# EAGLE board enut30d (EAGLE 4.11), part 1 of 2
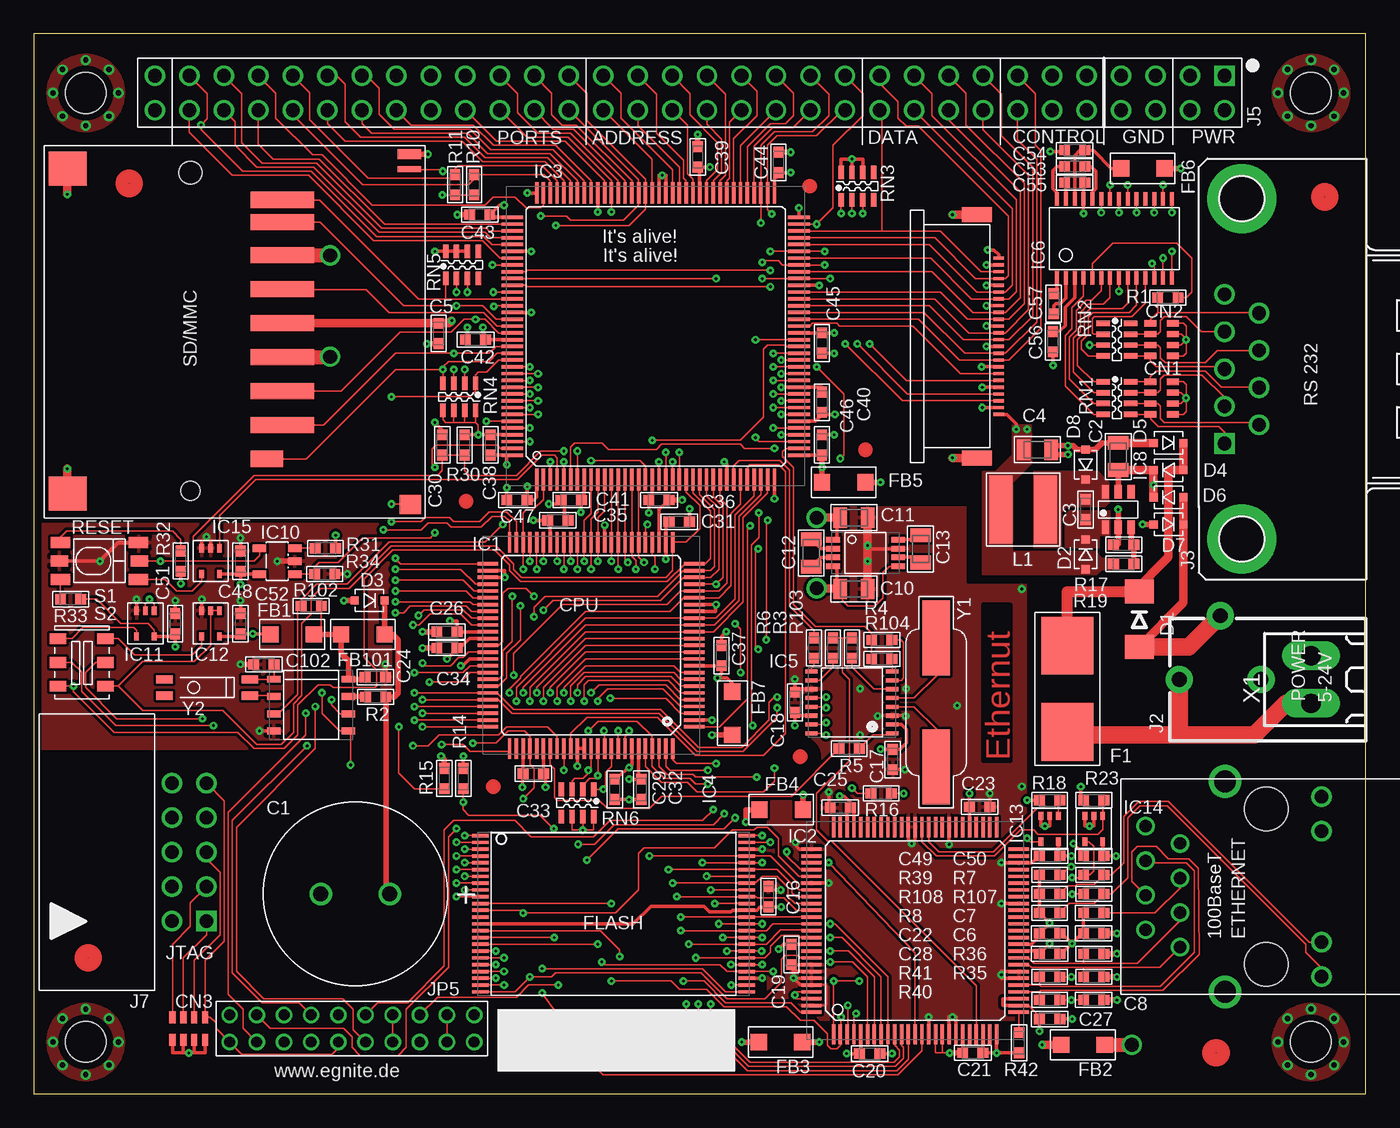
[diagram p4: board, top side]
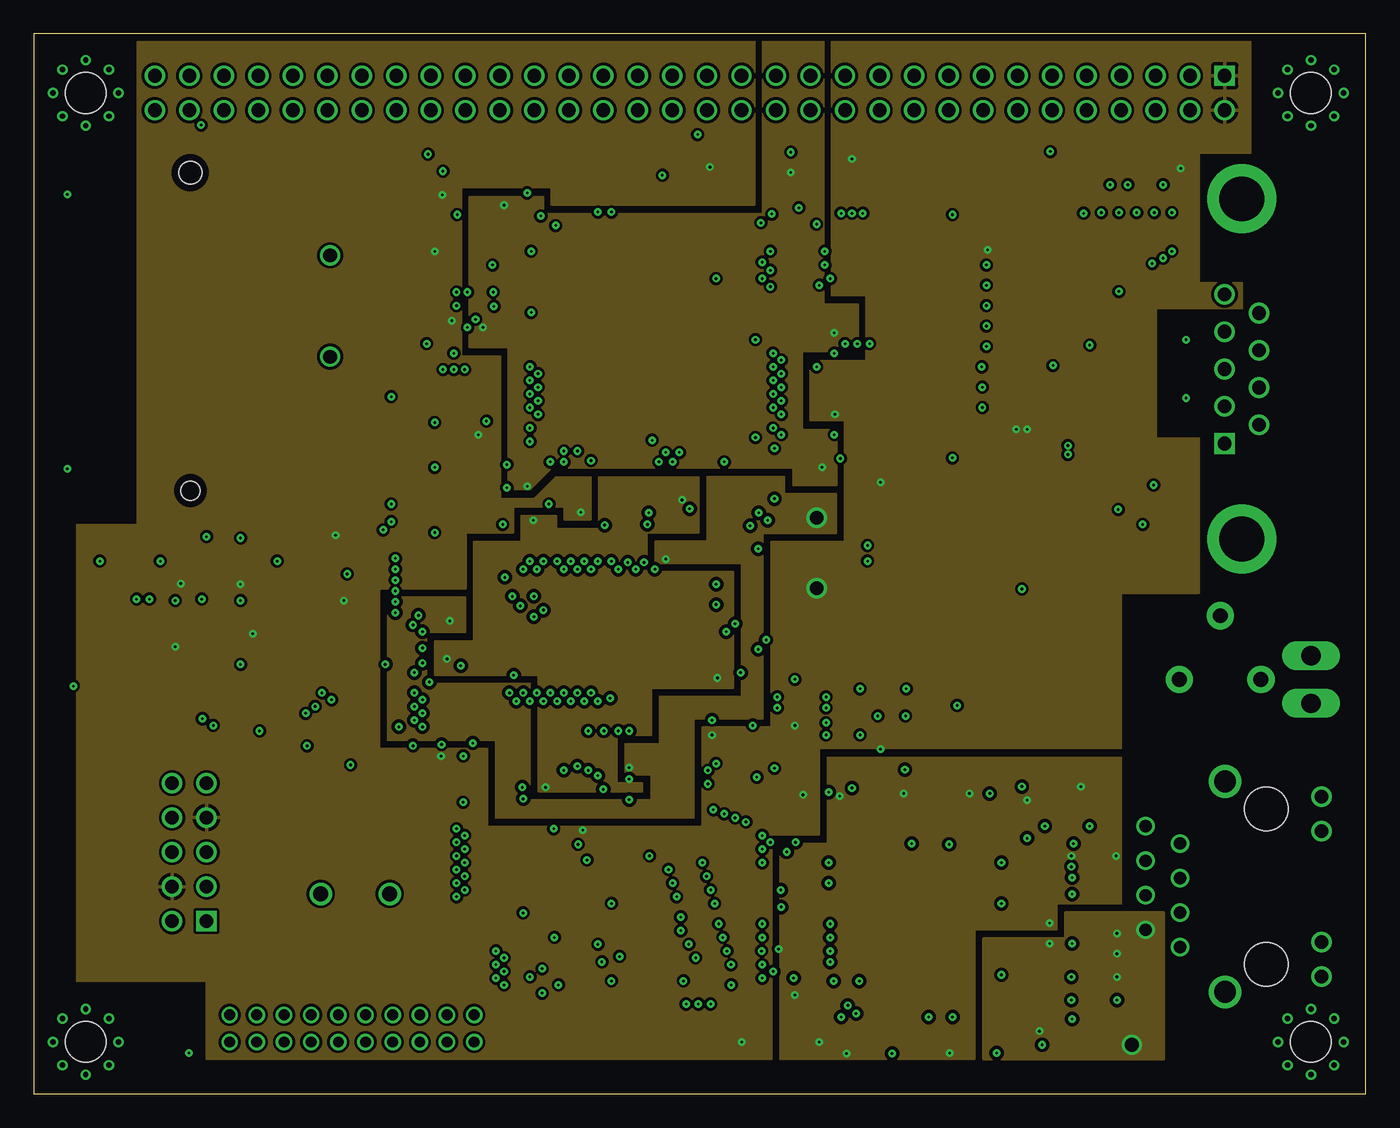
[diagram p5: board, inner layer Supply]
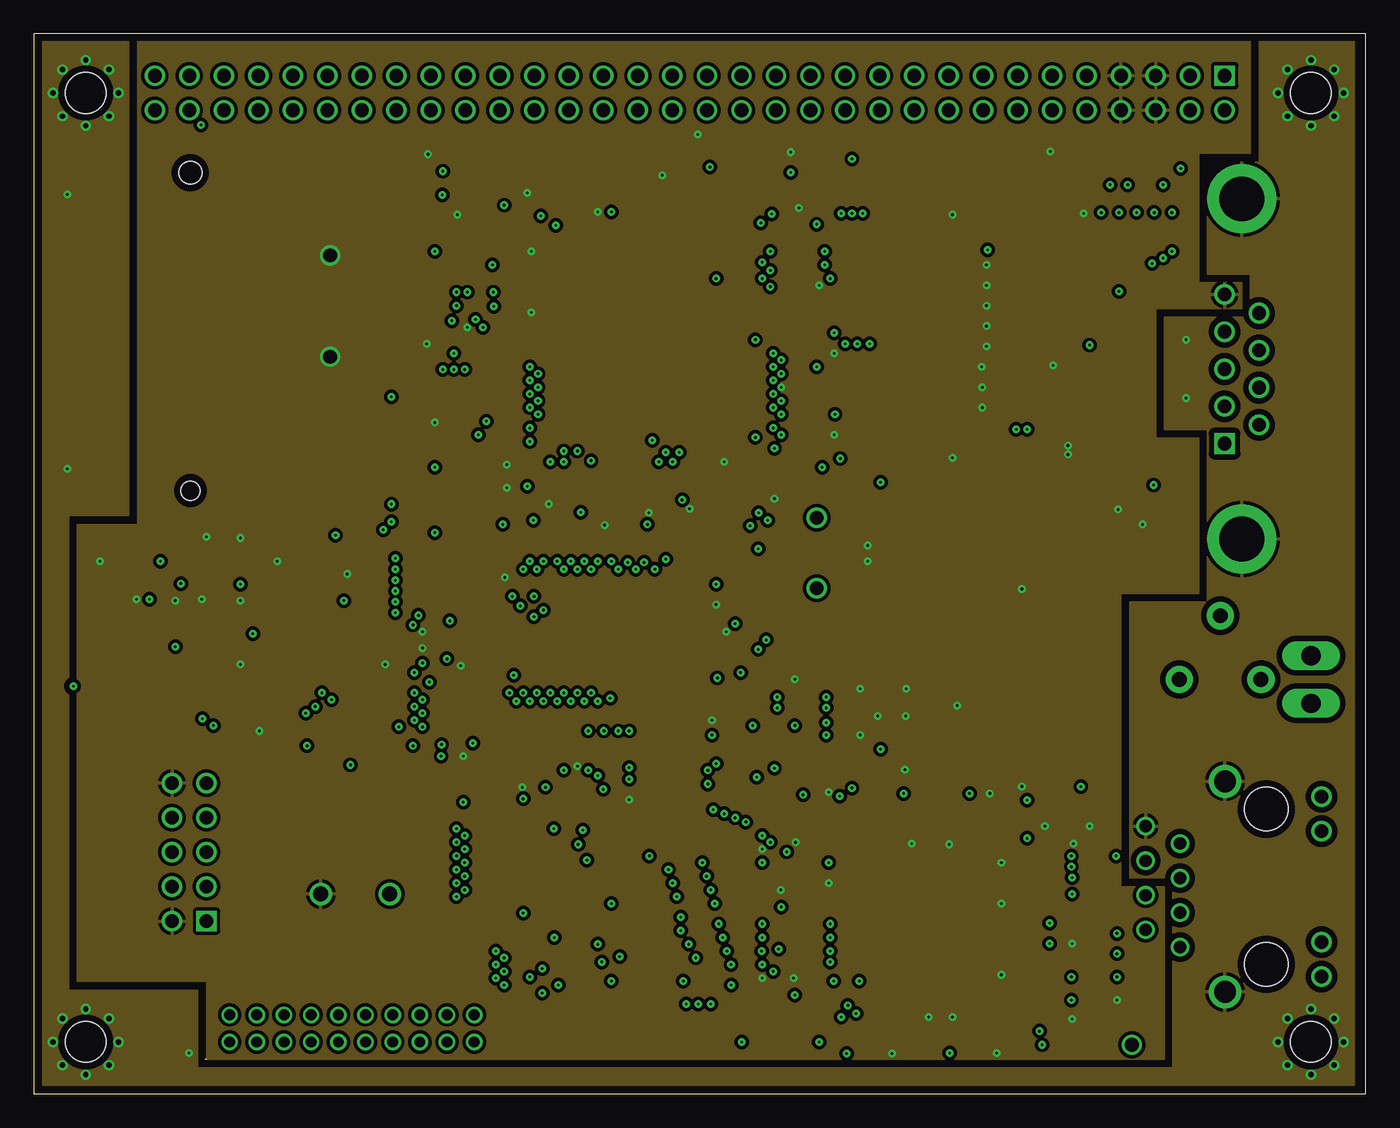
[diagram p6: board, inner layer Ground]
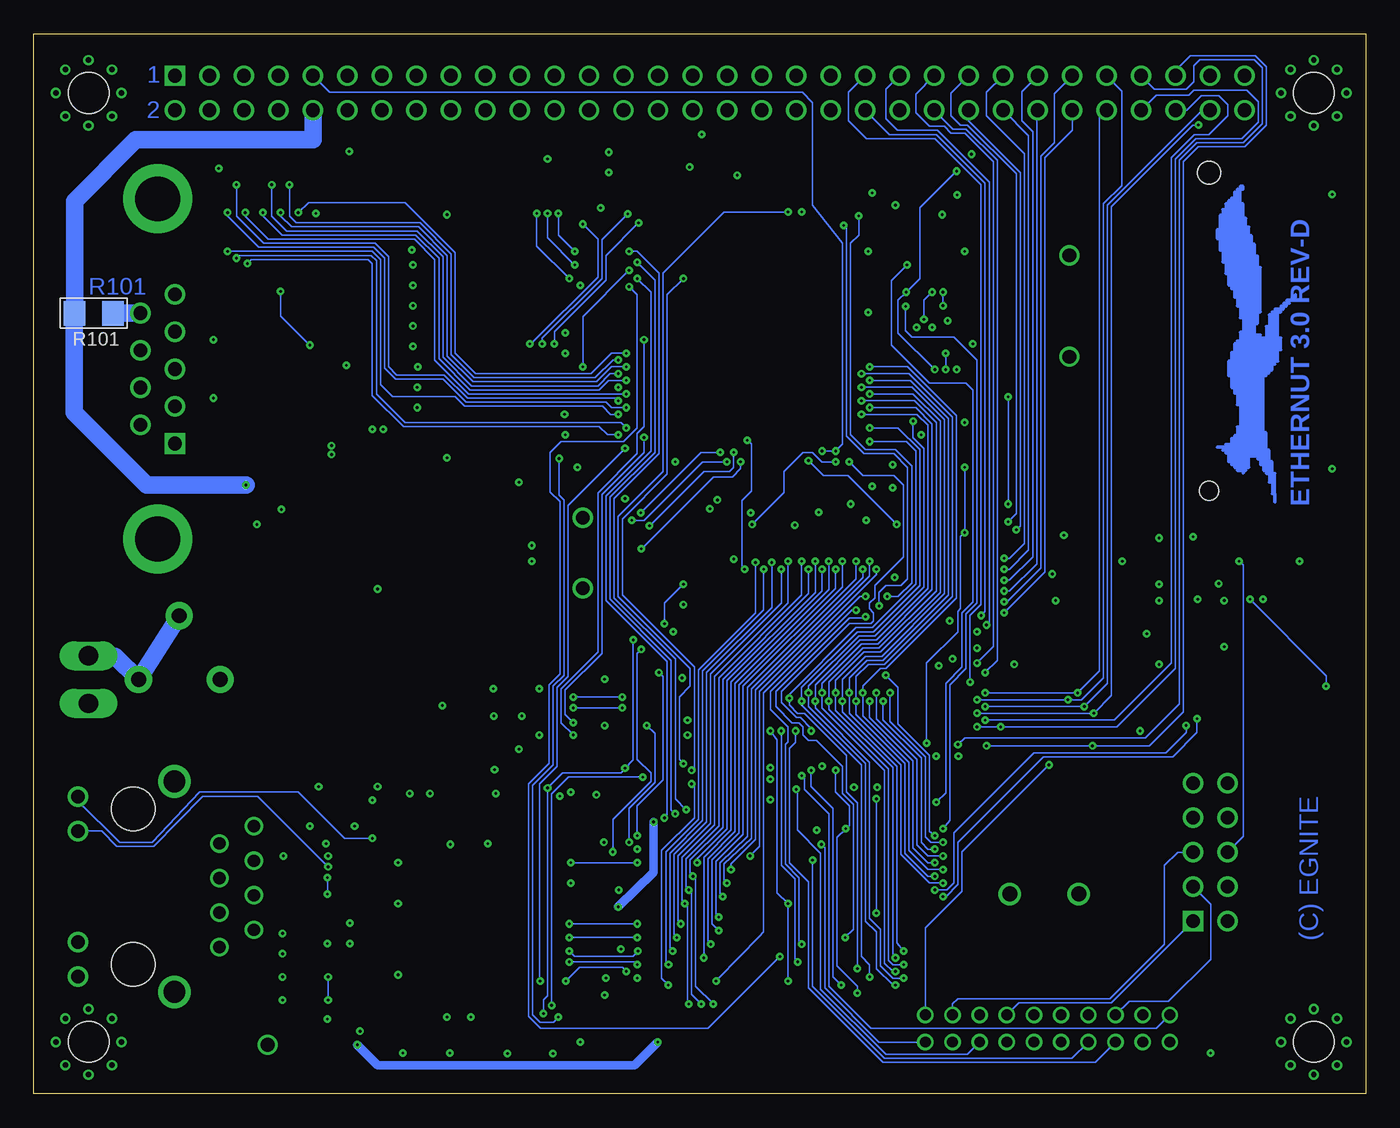
[diagram p7: board, bottom side, seen from below]

Size 98 x 78 mm. Coordinates in mm from the lower left corner, seen from the top.
Outline: 0,0 98,0 98,78 0,78 0,0
Copper layers (1*2+15*16): Top 0.035mm / dielectric 0.5mm / Supply 0.035mm / dielectric 0.5mm / Ground 0.035mm / dielectric 0.5mm / Bottom 0.035mm
Design rules "default": minimum track width 5mil, minimum drill 0.2mm, track to track 6mil, track to pad 6mil, pad to pad 8mil, via to via 8mil, smd to smd 8mil, copper to edge 20mil, drill to drill 12mil, minimum pad ring 8mil, minimum via ring 7mil, stop-mask expansion 0mil, vias tented up to drill 0.1mm, thermal gap 10mil
Net classes: 1 Supply1A: width 0.61 mm; 4 Ground: width 0.406 mm
Holes 3 mm at 3.81,73.66 93.98,73.66 3.81,3.81 93.98,3.81
tRestrict: area 69.9,24.5 to 71.8,36

## Footprints (pad centres in the part's own frame; a part is rotated, then mirrored left to right if it is on the bottom)
CDL13_5 = drill 1.1 pad 1.3 round: + 2.54,0; - -2.54,0
C0805 = smd 1 x 1.5: 1 -1,0; 2 1,0
C0603 = smd 0.8 x 0.75: 1 -0.75,0; 2 0.75,0
NCA1206 = smd 0.46 x 0.89: 1 -1.2,-0.825; 2 -0.4,-0.825; 3 0.4,-0.825; 4 1.2,-0.825; 5 1.2,0.825; 6 0.4,0.825; 7 -0.4,0.825; 8 -1.2,0.825
SMB = smd 1.778 x 2.159: A 2.032,0; C -2.032,0
SOD323 = smd 0.6 x 0.6: A 1.1,0; C -1.1,0
OMNI-BLOK = smd 4.242 x 3.81: 1 -3.175,0; 2 3.175,0
BLM31 = smd 1.2 x 1.2: 1 -1.6,0; 2 1.6,0
TQFP100 = smd 0.25 x 1.5: 1 -6,-7.6; 2 -5.5,-7.6; 3 -5,-7.6; 4 -4.5,-7.6; 5 -4,-7.6; 6 -3.5,-7.6; 7 -3,-7.6; 8 -2.5,-7.6; 9 -2,-7.6; 10 -1.5,-7.6; 11 -1,-7.6; 12 -0.5,-7.6; 13 0,-7.6; 14 0.5,-7.6; 15 1,-7.6; 16 1.5,-7.6; 17 2,-7.6; 18 2.5,-7.6; 19 3,-7.6; 20 3.5,-7.6; 21 4,-7.6; 22 4.5,-7.6; 23 5,-7.6; 24 5.5,-7.6; 25 6,-7.6; 51 6,7.6; 52 5.5,7.6; 53 5,7.6; 54 4.5,7.6; 55 4,7.6; 56 3.5,7.6; 57 3,7.6; 58 2.5,7.6; 59 2,7.6; 60 1.5,7.6; 61 1,7.6; 62 0.5,7.6; 63 0,7.6; 64 -0.5,7.6; 65 -1,7.6; 66 -1.5,7.6; 67 -2,7.6; 68 -2.5,7.6; 69 -3,7.6; 70 -3.5,7.6; 71 -4,7.6; 72 -4.5,7.6; 73 -5,7.6; 74 -5.5,7.6; 75 -6,7.6 | smd 1.5 x 0.25: 26 7.6,-6; 27 7.6,-5.5; 28 7.6,-5; 29 7.6,-4.5; 30 7.6,-4; 31 7.6,-3.5; 32 7.6,-3; 33 7.6,-2.5; 34 7.6,-2; 35 7.6,-1.5; 36 7.6,-1; 37 7.6,-0.5; 38 7.6,0; 39 7.6,0.5; 40 7.6,1; 41 7.6,1.5; 42 7.6,2; 43 7.6,2.5; 44 7.6,3; 45 7.6,3.5; 46 7.6,4; 47 7.6,4.5; 48 7.6,5; 49 7.6,5.5; 50 7.6,6; 76 -7.6,6; 77 -7.6,5.5; 78 -7.6,5; 79 -7.6,4.5; 80 -7.6,4; 81 -7.6,3.5; 82 -7.6,3; 83 -7.6,2.5; 84 -7.6,2; 85 -7.6,1.5; 86 -7.6,1; 87 -7.6,0.5; 88 -7.6,0; 89 -7.6,-0.5; 90 -7.6,-1; 91 -7.6,-1.5; 92 -7.6,-2; 93 -7.6,-2.5; 94 -7.6,-3; 95 -7.6,-3.5; 96 -7.6,-4; 97 -7.6,-4.5; 98 -7.6,-5; 99 -7.6,-5.5; 100 -7.6,-6
LQFP100 = smd 0.25 x 1.5: 1 -6,-7.625; 2 -5.5,-7.625; 3 -5,-7.625; 4 -4.5,-7.625; 5 -4,-7.625; 6 -3.5,-7.625; 7 -3,-7.625; 8 -2.5,-7.625; 9 -2,-7.625; 10 -1.5,-7.625; 11 -1,-7.625; 12 -0.5,-7.625; 13 0,-7.625; 14 0.5,-7.625; 15 1,-7.625; 16 1.5,-7.625; 17 2,-7.625; 18 2.5,-7.625; 19 3,-7.625; 20 3.5,-7.625; 21 4,-7.625; 22 4.5,-7.625; 23 5,-7.625; 24 5.5,-7.625; 25 6,-7.625; 51 6,7.625; 52 5.5,7.625; 53 5,7.625; 54 4.5,7.625; 55 4,7.625; 56 3.5,7.625; 57 3,7.625; 58 2.5,7.625; 59 2,7.625; 60 1.5,7.625; 61 1,7.625; 62 0.5,7.625; 63 0,7.625; 64 -0.5,7.625; 65 -1,7.625; 66 -1.5,7.625; 67 -2,7.625; 68 -2.5,7.625; 69 -3,7.625; 70 -3.5,7.625; 71 -4,7.625; 72 -4.5,7.625; 73 -5,7.625; 74 -5.5,7.625; 75 -6,7.625 | smd 1.5 x 0.25: 26 7.625,-6; 27 7.625,-5.5; 28 7.625,-5; 29 7.625,-4.5; 30 7.625,-4; 31 7.625,-3.5; 32 7.625,-3; 33 7.625,-2.5; 34 7.625,-2; 35 7.625,-1.5; 36 7.625,-1; 37 7.625,-0.5; 38 7.625,0; 39 7.625,0.5; 40 7.625,1; 41 7.625,1.5; 42 7.625,2; 43 7.625,2.5; 44 7.625,3; 45 7.625,3.5; 46 7.625,4; 47 7.625,4.5; 48 7.625,5; 49 7.625,5.5; 50 7.625,6; 76 -7.625,6; 77 -7.625,5.5; 78 -7.625,5; 79 -7.625,4.5; 80 -7.625,4; 81 -7.625,3.5; 82 -7.625,3; 83 -7.625,2.5; 84 -7.625,2; 85 -7.625,1.5; 86 -7.625,1; 87 -7.625,0.5; 88 -7.625,0; 89 -7.625,-0.5; 90 -7.625,-1; 91 -7.625,-1.5; 92 -7.625,-2; 93 -7.625,-2.5; 94 -7.625,-3; 95 -7.625,-3.5; 96 -7.625,-4; 97 -7.625,-4.5; 98 -7.625,-5; 99 -7.625,-5.5; 100 -7.625,-6
XC95_TQ144 = smd 0.25 x 1.6: 1 -8.75,-10.55; 2 -8.25,-10.55; 3 -7.75,-10.55; 4 -7.25,-10.55; 5 -6.75,-10.55; 6 -6.25,-10.55; 7 -5.75,-10.55; 8 -5.25,-10.55; 9 -4.75,-10.55; 10 -4.25,-10.55; 11 -3.75,-10.55; 12 -3.25,-10.55; 13 -2.75,-10.55; 14 -2.25,-10.55; 15 -1.75,-10.55; 16 -1.25,-10.55; 17 -0.75,-10.55; 18 -0.25,-10.55; 19 0.25,-10.55; 20 0.75,-10.55; 21 1.25,-10.55; 22 1.75,-10.55; 23 2.25,-10.55; 24 2.75,-10.55; 25 3.25,-10.55; 26 3.75,-10.55; 27 4.25,-10.55; 28 4.75,-10.55; 29 5.25,-10.55; 30 5.75,-10.55; 31 6.25,-10.55; 32 6.75,-10.55; 33 7.25,-10.55; 34 7.75,-10.55; 35 8.25,-10.55; 36 8.75,-10.55; 73 8.75,10.55; 74 8.25,10.55; 75 7.75,10.55; 76 7.25,10.55; 77 6.75,10.55; 78 6.25,10.55; 79 5.75,10.55; 80 5.25,10.55; 81 4.75,10.55; 82 4.25,10.55; 83 3.75,10.55; 84 3.25,10.55; 85 2.75,10.55; 86 2.25,10.55; 87 1.75,10.55; 88 1.25,10.55; 89 0.75,10.55; 90 0.25,10.55; 91 -0.25,10.55; 92 -0.75,10.55; 93 -1.25,10.55; 94 -1.75,10.55; 95 -2.25,10.55; 96 -2.75,10.55; 97 -3.25,10.55; 98 -3.75,10.55; 99 -4.25,10.55; 100 -4.75,10.55; 101 -5.25,10.55; 102 -5.75,10.55; 103 -6.25,10.55; 104 -6.75,10.55; 105 -7.25,10.55; 106 -7.75,10.55; 107 -8.25,10.55; 108 -8.75,10.55 | smd 1.6 x 0.25: 37 10.55,-8.75; 38 10.55,-8.25; 39 10.55,-7.75; 40 10.55,-7.25; 41 10.55,-6.75; 42 10.55,-6.25; 43 10.55,-5.75; 44 10.55,-5.25; 45 10.55,-4.75; 46 10.55,-4.25; 47 10.55,-3.75; 48 10.55,-3.25; 49 10.55,-2.75; 50 10.55,-2.25; 51 10.55,-1.75; 52 10.55,-1.25; 53 10.55,-0.75; 54 10.55,-0.25; 55 10.55,0.25; 56 10.55,0.75; 57 10.55,1.25; 58 10.55,1.75; 59 10.55,2.25; 60 10.55,2.75; 61 10.55,3.25; 62 10.55,3.75; 63 10.55,4.25; 64 10.55,4.75; 65 10.55,5.25; 66 10.55,5.75; 67 10.55,6.25; 68 10.55,6.75; 69 10.55,7.25; 70 10.55,7.75; 71 10.55,8.25; 72 10.55,8.75; 109 -10.55,8.75; 110 -10.55,8.25; 111 -10.55,7.75; 112 -10.55,7.25; 113 -10.55,6.75; 114 -10.55,6.25; 115 -10.55,5.75; 116 -10.55,5.25; 117 -10.55,4.75; 118 -10.55,4.25; 119 -10.55,3.75; 120 -10.55,3.25; 121 -10.55,2.75; 122 -10.55,2.25; 123 -10.55,1.75; 124 -10.55,1.25; 125 -10.55,0.75; 126 -10.55,0.25; 127 -10.55,-0.25; 128 -10.55,-0.75; 129 -10.55,-1.25; 130 -10.55,-1.75; 131 -10.55,-2.25; 132 -10.55,-2.75; 133 -10.55,-3.25; 134 -10.55,-3.75; 135 -10.55,-4.25; 136 -10.55,-4.75; 137 -10.55,-5.25; 138 -10.55,-5.75; 139 -10.55,-6.25; 140 -10.55,-6.75; 141 -10.55,-7.25; 142 -10.55,-7.75; 143 -10.55,-8.25; 144 -10.55,-8.75
TSOP48 = smd 0.25 x 1.2: 1 -5.75,-9.8; 2 -5.25,-9.8; 3 -4.75,-9.8; 4 -4.25,-9.8; 5 -3.75,-9.8; 6 -3.25,-9.8; 7 -2.75,-9.8; 8 -2.25,-9.8; 9 -1.75,-9.8; 10 -1.25,-9.8; 11 -0.75,-9.8; 12 -0.25,-9.8; 13 0.25,-9.8; 14 0.75,-9.8; 15 1.25,-9.8; 16 1.75,-9.8; 17 2.25,-9.8; 18 2.75,-9.8; 19 3.25,-9.8; 20 3.75,-9.8; 21 4.25,-9.8; 22 4.75,-9.8; 23 5.25,-9.8; 24 5.75,-9.8; 25 5.75,9.8; 26 5.25,9.8; 27 4.75,9.8; 28 4.25,9.8; 29 3.75,9.8; 30 3.25,9.8; 31 2.75,9.8; 32 2.25,9.8; 33 1.75,9.8; 34 1.25,9.8; 35 0.75,9.8; 36 0.25,9.8; 37 -0.25,9.8; 38 -0.75,9.8; 39 -1.25,9.8; 40 -1.75,9.8; 41 -2.25,9.8; 42 -2.75,9.8; 43 -3.25,9.8; 44 -3.75,9.8; 45 -4.25,9.8; 46 -4.75,9.8; 47 -5.25,9.8; 48 -5.75,9.8
TSSOP16 = smd 0.3 x 0.9: 1 -2.275,-2.97; 2 -1.625,-2.97; 3 -0.975,-2.97; 4 -0.325,-2.97; 5 0.325,-2.97; 6 0.975,-2.97; 7 1.625,-2.97; 8 2.275,-2.97; 9 2.275,2.97; 10 1.625,2.97; 11 0.975,2.97; 12 0.325,2.97; 13 -0.325,2.97; 14 -0.975,2.97; 15 -1.625,2.97; 16 -2.275,2.97
TSSOP28 = smd 0.305 x 0.991: 1 -4.225,-2.918; 2 -3.575,-2.918; 3 -2.925,-2.918; 4 -2.275,-2.918; 5 -1.625,-2.918; 6 -0.975,-2.918; 7 -0.325,-2.918; 8 0.325,-2.918; 9 0.975,-2.918; 10 1.625,-2.918; 11 2.275,-2.918; 12 2.925,-2.918; 13 3.575,-2.918; 14 4.225,-2.918; 15 4.225,2.918; 16 3.575,2.918; 17 2.925,2.918; 18 2.275,2.918; 19 1.625,2.918; 20 0.975,2.918; 21 0.325,2.918; 22 -0.325,2.918; 23 -0.975,2.918; 24 -1.625,2.918; 25 -2.275,2.918; 26 -2.925,2.918; 27 -3.575,2.918; 28 -4.225,2.918
SO8 = smd 0.508 x 0.991: 1 -1.905,-2.743; 2 -0.635,-2.743; 3 0.635,-2.743; 4 1.905,-2.743; 5 1.905,2.743; 6 0.635,2.743; 7 -0.635,2.743; 8 -1.905,2.743
TSOT-23-6 = smd 0.54 x 1: 1 -0.95,-1.31; 2 0,-1.31; 3 0.95,-1.31; 4 0.95,1.31; 5 0,1.31; 6 -0.95,1.31
MSOP-8 = smd 0.41 x 1.02: 1 -0.975,-2.4; 2 -0.325,-2.4; 3 0.325,-2.4; 4 0.975,-2.4; 5 0.975,2.4; 6 0.325,2.4; 7 -0.325,2.4; 8 -0.975,2.4
SOT23-5L = smd 0.55 x 0.99: 1 -0.95,-1.3; 2 0,-1.3; 3 0.95,-1.3; 4 0.95,1.3; 5 -0.95,1.3
SOT353 = smd 0.35 x 0.6: 1 -0.65,-0.95; 2 0,-0.95; 3 0.65,-0.95; 4 0.65,0.95; 5 -0.65,0.95
TDC-002-3 = drill 1.1 pad 2 round: 1 -6.5,0; 2 -0.5,0; 3 -3.5,4.7
M09HP = drill 1.016 square: 1 -5.486,5.08 | drill 1.016 round: 2 -2.743,5.08; 3 0,5.08; 4 2.743,5.08; 5 5.486,5.08; 6 -4.115,2.54; 7 -1.372,2.54; 8 1.372,2.54; 9 4.115,2.54 | drill 3.302 pad 5.08 round: G1 -12.522,3.81; G2 12.522,3.81
FFC-52437 = smd 0.24 x 0.8: 1 -5.75,3.5; 2 -5.25,3.5; 3 -4.75,3.5; 4 -4.25,3.5; 5 -3.75,3.5; 6 -3.25,3.5; 7 -2.75,3.5; 8 -2.25,3.5; 9 -1.75,3.5; 10 -1.25,3.5; 11 -0.75,3.5; 12 -0.25,3.5; 13 0.25,3.5; 14 0.75,3.5; 15 1.25,3.5; 16 1.75,3.5; 17 2.25,3.5; 18 2.75,3.5; 19 3.25,3.5; 20 3.75,3.5; 21 4.25,3.5; 22 4.75,3.5; 23 5.25,3.5; 24 5.75,3.5 | smd 1.1 x 2.2: G1 -8.95,1.9; G2 8.95,1.9
NUTEXP = drill 1 square: 1 39.37,1.27 | drill 1 round: 2 39.37,-1.27; 3 36.83,1.27; 4 36.83,-1.27; 5 34.29,1.27; 6 34.29,-1.27; 7 31.75,1.27; 8 31.75,-1.27; 9 29.21,1.27; 10 29.21,-1.27; 11 26.67,1.27; 12 26.67,-1.27; 13 24.13,1.27; 14 24.13,-1.27; 15 21.59,1.27; 16 21.59,-1.27; 17 19.05,1.27; 18 19.05,-1.27; 19 16.51,1.27; 20 16.51,-1.27; 21 13.97,1.27; 22 13.97,-1.27; 23 11.43,1.27; 24 11.43,-1.27; 25 8.89,1.27; 26 8.89,-1.27; 27 6.35,1.27; 28 6.35,-1.27; 29 3.81,1.27; 30 3.81,-1.27; 31 1.27,1.27; 32 1.27,-1.27; 33 -1.27,1.27; 34 -1.27,-1.27; 35 -3.81,1.27; 36 -3.81,-1.27; 37 -6.35,1.27; 38 -6.35,-1.27; 39 -8.89,1.27; 40 -8.89,-1.27; 41 -11.43,1.27; 42 -11.43,-1.27; 43 -13.97,1.27; 44 -13.97,-1.27; 45 -16.51,1.27; 46 -16.51,-1.27; 47 -19.05,1.27; 48 -19.05,-1.27; 49 -21.59,1.27; 50 -21.59,-1.27; 51 -24.13,1.27; 52 -24.13,-1.27; 53 -26.67,1.27; 54 -26.67,-1.27; 55 -29.21,1.27; 56 -29.21,-1.27; 57 -31.75,1.27; 58 -31.75,-1.27; 59 -34.29,1.27; 60 -34.29,-1.27; 61 -36.83,1.27; 62 -36.83,-1.27; 63 -39.37,1.27; 64 -39.37,-1.27
FPS009-2700 = smd 4.7 x 1.2: 1 -3.51,6.85; 2 -3.51,4.35; 3 -3.51,1.85; 4 -3.51,-0.65; 5 -3.51,-3.15; 6 -3.51,-5.65; 7 -3.51,-8.08; 8 -3.51,-9.71 | smd 2.4 x 1.2: 9 -2.36,9.35 | smd 1.75 x 0.75: C -12.865,-13.09 | smd 1.75 x 0.45: CD -12.865,-11.965 | smd 2.8 x 2.5: CH1 12.29,11.91; CH2 12.29,-12 | smd 1.6 x 1.4: WP -12.94,12.71 | hole 1.4: 3.26,11.68 | hole 1.7: 3.26,-11.72
ML10A = drill 1 pad 1.422 square: 1 -5.08,-6.35 | drill 1 pad 1.422 round: 2 -5.08,-3.81; 3 -2.54,-6.35; 4 -2.54,-3.81; 5 0,-6.35; 6 0,-3.81; 7 2.54,-6.35; 8 2.54,-3.81; 9 5.08,-6.35; 10 5.08,-3.81
LJ1003 = drill 0.9 round: 1 -6.452,-4.445; 2 -8.992,-3.175; 3 -6.452,-1.905; 4 -8.992,-0.635; 5 -6.452,0.635; 6 -8.992,1.905; 7 -6.452,3.175; 8 -8.992,4.445 | drill 1 round: 9 3.962,-6.629; 10 3.962,-4.089; 11 3.962,4.089; 12 3.962,6.629 | drill 1.6 round: S1 -3.15,-7.747; S2 -3.15,7.747 | hole 3.2: -0.102,-5.715; -0.102,5.715
JP10X2 = drill 0.8 round: 1 -9,-1; 2 -9,1; 3 -7,-1; 4 -7,1; 5 -5,-1; 6 -5,1; 7 -3,-1; 8 -3,1; 9 -1,-1; 10 -1,1; 11 1,-1; 12 1,1; 13 3,-1; 14 3,1; 15 5,-1; 16 5,1; 17 7,-1; 18 7,1; 19 9,-1; 20 9,1
MSS5131 = smd 5 x 1.7: 1 0,-1.65; 2 0,1.65
R0603 = smd 0.8 x 0.75: 1 -0.75,0; 2 0.75,0
R1206 = smd 1.6 x 1.803: 1 -1.422,0; 2 1.422,0
CAY16 = smd 0.4 x 1: 1 -1.2,-1; 2 -0.4,-1; 3 0.4,-1; 4 1.2,-1; 5 1.2,1; 6 0.4,1; 7 -0.4,1; 8 -1.2,1
PTS-026 = smd 1.45 x 0.8: A1 2.875,-1.35; A2 2.875,1.35; C1 -2.875,-1.35; C2 -2.875,1.35 | smd 1.3 x 0.8: S1 2.95,0; S2 -2.95,0
CAS-D20A1 = smd 0.8 x 1.2: 1 -1.75,-1.75; 2 0,-1.75; 3 1.75,-1.75; 4 -1.75,1.75; 5 0,1.75; 6 1.75,1.75
180-2 = drill 1.422 long: 1 -1.75,0; 2 1.75,0
HC49SM = smd 5.5 x 2: 1 -4.75,0; 2 4.75,0
MC-146 = smd 1.2 x 0.6: 1 -3.15,-0.6; 2 3.15,-0.6; 3 3.15,0.6; 4 -3.15,0.6

## Placement (x,y rotation side)
C1  0.1F  [CDL13_5]  23.65,14.7 0 top
C2  1u  [C0805]  79.8,46.9 90 top
C3  10n  [C0603]  77.4,43 90 top
C4  10u  [C0805]  73.85,47.4 0 top
C5  470n  [C0603]  29.78,55.95 270 top
C6  100n  [C0603]  78,11.8 180 top
C7  100n  [C0603]  78,13.3 180 top
C8  100n  [C0603]  78,6.9 0 top
C10  10u  [C0805]  60.35,37.15 0 top
C11  10u  [C0805]  60.35,42.4 0 top
C12  1u  [C0805]  57.2,39.8 90 top
C13  1u  [C0805]  65.25,40.1 90 top
C16  100n  [C0603]  54.05,14.5 90 top
C17  100n  [C0603]  63.2,24.6 270 top
C18  100n  [C0603]  56,28.8 90 top
C19  100n  [C0603]  55.75,10.25 270 top
C20  100n  [C0603]  61.5,2.95 0 top
C21  100n  [C0603]  69.1,3 0 top
C22  100n  [C0603]  74.75,11.8 0 top
C23  100n  [C0603]  69.6,21.1 0 top
C24  100n  [C0603]  25.13,30.66 0 top
C25  100n  [C0603]  59.35,21.05 180 top
C26  100n  [C0603]  30.4,34 180 top
C27  100n  [C0603]  74.75,5.5 0 top
C28  100n  [C0603]  74.75,10.3 0 top
C29  100n  [C0603]  42.75,22.4 270 top
C30  100n  [C0603]  30.05,47.75 90 top
C31  100n  [C0603]  47.5,42.1 0 top
C32  100n  [C0603]  44.7,22.4 270 top
C33  100n  [C0603]  36.75,23.55 180 top
C34  100n  [C0603]  30.4,32.8 180 top
C35  100n  [C0603]  38.55,42.2 0 top
C36  100n  [C0603]  46,43.7 180 top
C37  100n  [C0603]  50.6,32.25 90 top
C38  100n  [C0603]  33.6,47.75 270 top
C39  100n  [C0603]  48.85,68.95 90 top
C40  100n  [C0603]  58,50.9 90 top
C41  100n  [C0603]  39.55,43.7 180 top
C42  100n  [C0603]  32.5,55.5 180 top
C43  100n  [C0603]  32.8,64.7 180 top
C44  100n  [C0603]  54.8,68.55 90 top
C45  100n  [C0603]  58,55.25 270 top
C46  100n  [C0603]  58,47.75 90 top
C47  100n  [C0603]  35.55,43.7 180 top
C48  100n  [C0603]  15.2,39.2 90 top
C49  100n  [C0603]  74.75,17.5 180 top
C50  100n  [C0603]  78,17.5 180 top
C51  100n  [C0603]  10.4,34.6 90 top
C52  100n  [C0603]  15.2,34.6 90 top
C53  100n  [C0603]  76.6,69.45 180 top
C54  100n  [C0603]  76.6,68.25 0 top
C55  470n  [C0603]  76.6,67.05 0 top
C56  470n  [C0603]  75,55.35 270 top
C57  470n  [C0603]  75.05,58.15 270 top
C102  22p  [C0603]  16.93,31.6 0 top
CN1  220p  [NCA1206]  83,51.2 90 top
CN2  220p  [NCA1206]  83,55.5 270 top
CN3  10p  [NCA1206]  11.4,4.8 180 top
D1  SM6T24CA  [SMB]  81.35,34.92 270 top
D2  PMEG3005AEA  [SOD323]  77.4,39.7 270 top
D3  PMEG2005AEA  [SOD323]  24.7,36.3 180 top
D4  PMEG3005AEA  [SOD323]  83.5,45.9 0 top
D5  PMEG3005AEA  [SOD323]  83.5,47.9 180 top
D6  PMEG3005AEA  [SOD323]  83.5,43.9 0 top
D7  PMEG3005AEA  [SOD323]  83.5,41.9 180 top
D8  PMEG3005AEA  [SOD323]  77.4,46.3 90 top
F1  1A  [OMNI-BLOK]  76.05,29.8 90 top
FB1  BLM31A  [BLM31]  19,33.8 0 top
FB2  [BLM31]  77.2,3.6 180 top
FB3  [BLM31]  54.95,3.8 180 top
FB4  [BLM31]  55,20.9 0 top
FB5  [BLM31]  59.6,45 0 top
FB6  [BLM31]  81.6,68.1 0 top
FB7  [BLM31]  51.4,28 270 top
FB101  BLM31A  [BLM31]  24.2,33.8 180 top
IC1  AT91R40008  [TQFP100]  41,33 90 top
IC2  DM9000E  [LQFP100]  64.85,12 0 top
IC3  XC95144XLTQ144  [XC95_TQ144]  45.75,55.75 0 top
IC4  AT49BV322A-70TI  [TSOP48]  42.65,13.25 270 top
IC5  CY22393  [TSSOP16]  60.2,28.8 90 top
IC6  MAX3243UI  [TSSOP28]  79.52,62.95 0 top
IC7  X1226S8  [SO8]  20.4,28.6 270 top
IC8  LT1616  [TSOT-23-6]  79.8,43 0 top
IC9  LM2788MM-1.8  [MSOP-8]  61.2,39.8 270 top
IC10  MIC2775-46BM5  [SOT23-5L]  17.9,39.2 90 top
IC11  74LVC1G00GW  [SOT353]  8.2,34.6 180 top
IC12  74LVC1G00GW  [SOT353]  13,34.6 180 top
IC13  74LVC1G125GW  [SOT353]  74.75,19.5 180 top
IC14  74LVC1G125GW  [SOT353]  78,19.5 180 top
IC15  74LVC1G125GW  [SOT353]  13,39.2 180 top
J2  2mm  [TDC-002-3]  90.81,30.48 0 top
J3  M09HP  [M09HP]  92.71,53.34 90 top
J4  FCC24  [FFC-52437]  67.5,55.75 270 top
J5  [NUTEXP]  48.26,73.66 0 top
J6  FPS009-2700  [FPS009-2700]  14.77,56.07 180 top
J7  [ML10A]  6.35,17.78 90 top
J8  LJ1003  [LJ1003]  90.81,15.24 0 top
JP5  JP10X2  [JP10X2]  23.4,4.8 180 top
L1  10u  [MSS5131]  72.8,43 270 top
LOGO  [LOGO]  5.17,43.52 90 bottom
R1  0  [R0603]  83.45,58.6 0 top
R2  0  [R0603]  25.15,29.2 0 top
R3  22  [R0603]  58.8,32.8 90 top
R4  22  [R0603]  62.4,33.4 180 top
R5  22  [R0603]  60,25.4 180 top
R6  22  [R0603]  57.4,32.8 90 top
R7  0  [R0603]  78,16.1 180 top
R8  180  [R0603]  74.75,13.3 180 top
R10  10k  [R0603]  32.4,66.9 90 top
R11  10k  [R0603]  31,66.9 90 top
R14  10k  [R0603]  31.6,23.2 270 top
R15  100k  [R0603]  30.2,23.2 270 top
R16  100k  [R0603]  62.35,22.1 180 top
R17  10k  [R0603]  80.2,40.4 0 top
R18  10k  [R0603]  74.75,21.6 180 top
R19  16.5k  [R0603]  80.2,39 180 top
R23  10k  [R0603]  78,21.6 180 top
R30  10k  [R0603]  31.7,47.75 90 top
R31  100k  [R0603]  21.45,40.15 0 top
R32  180  [R0603]  10.8,39.2 270 top
R33  180  [R0603]  2.7,36.4 0 top
R34  100k  [R0603]  21.4,38.25 0 top
R35  50 1%  [R0603]  78,8.6 0 top
R36  50 1%  [R0603]  78,10.3 0 top
R39  180  [R0603]  74.75,16.1 180 top
R40  50 1%  [R0603]  74.75,6.9 180 top
R41  50 1%  [R0603]  74.75,8.6 180 top
R42  6.8k 1%  [R0603]  72.5,3.75 90 top
R101  0  [R1206]  93.6,57.45 180 bottom
R102  100k  [R0603]  20.4,35.9 0 top
R103  22  [R0603]  60.2,32.8 90 top
R104  22  [R0603]  62.4,32 180 top
R107  0  [R0603]  78,14.7 180 top
R108  180  [R0603]  74.75,14.7 180 top
RN1  22  [CAY16]  79.7,51.2 270 top
RN2  22  [CAY16]  79.7,55.5 270 top
RN3  100k  [CAY16]  60.6,66.8 0 top
RN4  10k  [CAY16]  31.3,51.3 180 top
RN5  10k  [CAY16]  31.5,61 0 top
RN6  100k  [CAY16]  40,21.4 180 top
S1  SW-LED  [PTS-026]  4.82,39.21 180 top
S2  CAS-D20A1  [CAS-D20A1]  3.52,31.74 270 top
U$10  [MARK1]  31.8,43.6 0 top
U$11  [MARK1]  56.4,24.8 0 top
U$12  [MARK1]  33.8,22.6 0 top
U$13  [MARK1]  57.1,66.8 0 top
U$14  [MARK1]  61.2,47.4 0 top
U$16  [MARK2]  95,66 0 top
X1  [180-2]  93.98,30.48 90 top
X4Y10  [MARK2]  4,10 0 top
X7Y67  [MARK2]  7,67 0 top
X87Y3  [MARK2]  87,3 0 top
Y1  25MHz  [HC49SM]  66.4,28.8 270 top
Y2  32.768kHz  [MC-146]  12.75,29.9 180 top

## Tracks (layer width: path | path; a pad name or v marks a point on that pad's centre or on a via)
A0  (via drill 0.2)
  Top 0.127: IC3.20 46.5,46.5 v46.5,47.2 | v52.7,41.8 52.5,41.6 52.5,29.05 50.45,27 IC1.1
  Bottom 0.127: v46.5,47.2 46.5,46.1 46.8,45.8 48.7,45.8 v52.7,41.8
A1  (via drill 0.2)
  Top 0.127: v36.5,48 IC3.142 | IC4.25 50.9,7.5 49.2,9.2 v37.4,9.2 | IC1.3 47.6,28 46.5,29.1 v42.4,29.1
  Bottom 0.127: v37.4,9.2 37.4,21.4 38.2,22.2 38.2,24.9 41.3,28 41.8,28 42.4,28.6 v42.4,29.1 42.4,29.4 37.5,34.3 36.3,34.3 33.1,37.5 33.1,47.3 33.8,48 v36.5,48
A2  (via drill 0.2)
  Top 0.127: IC3.140 35,49 v36.5,49 | IC4.24 34.4,7.5 35.4,7.5 v36.5,8.6 38.1,8.6 38.4,8.9 49.1,8.9 51,7 53.8,7 55,8.2 55,9.9 55.3,10.2 56.2,10.2 56.4,10 IC2.92 | IC1.4 47.6,28.5 46.3,29.8 42.2,29.8 41.5,29.1 v41.5,28.9
  Bottom 0.127: v36.5,8.6 36.5,9.5 37.1,10.1 37.1,24.2 41.5,28.6 v41.5,28.9 41.5,29.9 37.4,34 36.2,34 32.8,37.4 32.8,47.4 34.4,49 v36.5,49
A3  (via drill 0.2)
  Top 0.127: 34.85,49.5 | 34.85,49.5 IC3.139 | v33.3,49.5 34.85,49.5 | IC4.23 v34.6,8 | v41,29.5 41.6,30.1 46.5,30.1 47.6,29 IC1.5
  Bottom 0.127: v33.3,49.5 33.3,48.3 32.5,47.5 32.5,37.3 36.1,33.7 37.3,33.7 41,30 v41,29.5 41,28.5 36.8,24.3 36.8,12.7 36,11.9 36,9.2 34.8,8 v34.6,8
A4  (via drill 0.2)
  Top 0.127: 34.95,50 | 34.95,50 IC3.138 | v37.1,50 34.95,50 | IC4.22 | IC4.22 v34,8.5 | v40.5,28.9 40.5,30.1 40.8,30.4 46.7,30.4 47.6,29.5 IC1.6
  Bottom 0.127: v37.1,50 33,50 32.2,49.2 32.2,37.2 36,33.4 37.2,33.4 40.5,30.1 v40.5,28.9 40.5,28.4 36.5,24.4 36.5,12.9 35.7,12.1 35.7,9.4 34.8,8.5 v34,8.5
A5  (via drill 0.2)
  Top 0.127: 34.9,50.5 | 34.9,50.5 IC3.137 | v36.5,50.5 34.9,50.5 | IC4.21 v34.6,9 | IC1.7 47.6,30 46.9,30.7 40.6,30.7 40,30.1 v40,29.5
  Bottom 0.127: v36.5,50.5 33.1,50.5 31.9,49.3 31.9,37.1 35.9,33.1 37.1,33.1 40,30.2 v40,29.5 40,28.4 35.4,23.8 35.4,9.6 34.8,9 v34.6,9
A6  (via drill 0.2)
  Top 0.127: 34.95,51 | 34.95,51 IC3.136 | v37.1,51 34.95,51 | IC4.20 | IC4.20 v34,9.5 | IC1.8 47.6,30.5 47.1,31 40.5,31 39.5,30 v39.5,28.9
  Bottom 0.127: v37.1,51 33.2,51 31.6,49.4 31.6,37 35.8,32.8 37,32.8 39.5,30.3 v39.5,28.9 39.5,28.3 35.1,23.9 35.1,9.8 34.8,9.5 v34,9.5
A7  (via drill 0.2)
  Top 0.127: v36.5,51.5 IC3.135 35,51.5 | IC4.19 v34.6,10 | v39,29.5 39,29.9 40.6,31.5 47.1,31.5 47.6,31 IC1.9
  Bottom 0.127: v36.5,51.5 33.3,51.5 31.3,49.5 31.3,36.9 35.7,32.5 36.9,32.5 39,30.4 v39,29.5 39,28.2 34.8,24 34.8,10.3 v34.6,10
A8  (via drill 0.2)
  Top 0.127: 34.95,52 | 34.95,52 IC3.134 | v37.1,52 34.95,52 | IC4.18 | IC4.18 v34,10.5 | IC1.11 40.6,32 38.5,29.9 v38.5,28.9
  Bottom 0.127: v37.1,52 33.4,52 31,49.6 31,36.8 35.6,32.2 36.8,32.2 38.5,30.5 v38.5,28.9 | v38.5,28.9 38.5,28.1 34.5,24.1 34.5,11.1 v34,10.5 | v38.5,28.9 38.5,29.8
A9  (via drill 0.2)
  Top 0.127: 34.95,52.5 | 34.95,52.5 IC3.133 | v36.5,52.5 34.95,52.5 | 31.35,15.5 v31.1,15.5 | IC4.8 31.35,15.5 | 31.35,15.5 | IC1.12 40.6,32.5 38,29.9 v38,29.5
  Bottom 0.127: v36.5,52.5 33.5,52.5 30.7,49.7 30.7,36.7 35.5,31.9 36.7,31.9 38,30.6 v38,29.5 38,28 34.2,24.2 34.2,17.6 32.1,15.5 v31.1,15.5
A10  (via drill 0.2)
  Top 0.127: IC4.7 v31.7,16 | IC3.132 35,53 v37.1,53 | IC1.13 40.6,33 37.5,29.9 v37.5,28.9
  Bottom 0.127: v31.7,16 32.2,16 33.9,17.7 33.9,24.3 37.5,27.9 v37.5,28.9 37.5,30.7 36.6,31.6 35.4,31.6 30.4,36.6 30.4,49.8 33.6,53 v37.1,53
A11  (via drill 0.2)
  Top 0.127: 31.45,16.5 v31.1,16.5 | IC4.6 31.45,16.5 | 31.45,16.5 | v36.5,53.5 36.15,53.5 | 36.15,53.5 IC3.131 | 36.15,53.5 | IC1.14 40.6,33.5 37,29.9 v37,29.5
  Bottom 0.127: v31.1,16.5 32.2,16.5 33.6,17.9 33.6,24.4 37,27.8 v37,29.5 37,30 35.7,31.3 35.3,31.3 30.1,36.5 30.1,49.9 33.7,53.5 v36.5,53.5
A12  (via drill 0.2)
  Top 0.127: IC3.35 54,44.2 52.2,42.4 52.2,36.2 50,34 IC1.15 40.6,34 36.5,29.9 v36.5,28.9 | IC4.5 v31.7,17
  Bottom 0.127: v31.7,17 32.2,17 33.3,18.1 33.3,24.5 36.5,27.7 v36.5,28.9
A13  (via drill 0.2)
  Top 0.127: IC3.34 53.5,44.1 51.9,42.5 51.9,36.3 50.1,34.5 IC1.16 40.6,34.5 36,29.9 v36,29.5 | 31.45,17.5 v31.1,17.5 | IC4.4 31.45,17.5 | 31.45,17.5
  Bottom 0.127: v31.1,17.5 32.2,17.5 33,18.3 33,24.6 36,27.6 v36,29.5
A14  (via drill 0.2)
  Top 0.127: IC3.33 53,44 51.6,42.6 51.6,36.4 50.2,35 IC1.17 40.6,35 35.5,29.9 v35.5,28.9 | IC4.3 v31.7,18
  Bottom 0.127: v31.7,18 32.2,18 32.7,18.5 32.7,24.7 35.5,27.5 v35.5,28.9
A15  (via drill 0.2)
  Top 0.127: IC3.31 52,43.4 51.3,42.7 51.3,37.4 50.4,36.5 IC1.20 47.8,36.5 46.8,35.5 40.6,35.5 35.8,30.7 35.8,30.6 35,29.8 v35,29.5 | IC4.2 31.3,18.5 v31.1,18.5
  Bottom 0.127: v31.1,18.5 32,18.5 32.4,18.9 32.4,24.8 35,27.4 v35,29.5
A16  (via drill 0.2)
  Top 0.127: IC3.28 50.5,43.8 51,43.3 51,37.6 50.4,37 IC1.21 47.6,37 46.6,36 38.9,36 35.3,32.4 v35.3,30.8 | IC4.1 v31.7,19
  Bottom 0.127: v31.7,19 32.1,19.3 32.1,24.9 34.4,27.2 34.4,29.9 v35.3,30.8
A17  (via drill 0.2)
  Top 0.127: IC3.27 50,43.9 50.7,43.2 50.7,38 v50.2,37.5 IC1.22 | IC4.48 | IC4.48 v53.6,19 | v52,31 52,34.2 v51.6,34.6
  Bottom 0.127: v51.6,34.6 51.6,36.1 v50.2,37.5 | v53.6,19 53.6,21.2 51.7,23.1 51.7,30.7 v52,31
A18  (via drill 0.2)
  Top 0.127: IC3.26 49.5,44 50.4,43.1 50.4,38.6 49.8,38 IC1.23 47.8,38 46.1,36.3 38.2,36.3 v37.5,35.6 | IC4.17 v41.5,11
  Bottom 0.127: v41.5,11 41.7,11.2 41.7,15.9 42.7,16.9 42.7,25.7 42.5,25.9 42.5,27 43.8,28.3 43.8,29.6 37.8,35.6 v37.5,35.6
A19  (via drill 0.2)
  Top 0.127: IC4.16 34.35,11.5 v38.3,11.5 | IC3.25 49,44.1 50.1,43 50.1,38.8 49.8,38.5 IC1.24 47.8,38.5 45.9,36.6 37.6,36.6 36.8,35.8 v36.8,35.1
  Bottom 0.127: v38.3,11.5 37.7,12.1 37.7,21.3 38.5,22.1 38.5,24.1 40.4,26 41,26 41.4,26.4 41.4,27 41.7,27.3 42.2,27.3 43.4,28.5 43.4,29.6 38,35 36.9,35 v36.8,35.1
A20  (via drill 0.2)
  Top 0.127: IC3.24 48.5,44.2 49.8,42.9 49.8,39.4 49.4,39 IC1.25 48.5,39 | 48.5,39 48.2,39 | 48.5,39 47.9,39 46.6,37.7 35.8,37.7 35,38.5 35,38.9 33.9,40 26.4,40 24.3,37.9 24.3,32.1 25.2,31.2 25.2,30 25.1,29.9 22,29.9 21.8,30.1 20.9,30.1 19.4,28.6 19.4,26.4 18.4,25.4 16.2,25.4 15,26.6 5.9,26.6 2.9,29.6 v2.9,30 S2.3 | IC11.2 8.2,36.05 v8.5,36.4 8.85,36.05 IC11.1
  Bottom 0.127: v2.9,30 2.9,30.75 v8.5,36.4
A20\
  Top 0.127: IC11.4 7.55,34.1 7.35,34.3 3.6,34.3 2.8,33.5 2.05,33.5 2.04,33.49 S2.1
A21
  Top 0.127: IC12.1 IC12.2 13,33 11.8,31.8 8,31.8 6.2,30 | IC3.23 48,44.3 49,43.3 49,41.6 48,40.6 IC1.26 47,38.5 46.5,38 35.9,38 35.3,38.6 35.3,39 34,40.3 26.3,40.3 23.2,37.2 21.1,37.2 20.4,36.5 20.4,35.3 19.7,34.6 19.7,29.3 19.1,28.7 19.1,26.6 18.2,25.7 16.4,25.7 13.9,28.2 8,28.2 6.2,30 | S2.6 6.2,30
A21\
  Top 0.127: IC12.4 12.35,33 11.65,32.3 7.4,32.3 6.2,33.5 5.45,33.5 5.44,33.49 S2.4
A22  (via drill 0.2)
  Top 0.127: IC1.29 45.5,39.7 45.7,39.5 v45.7,38.6 | v45.5,48.1 52,48.1 53.7,49.8 53.7,54.8 54,55.1 55.3,55.1 55.4,55 IC3.53
  Bottom 0.127: v45.5,48.1 45.2,47.8 45.2,44.35 45.9,43.65 45.9,38.8 v45.7,38.6
A23  (via drill 0.2)
  Top 0.127: IC3.5 39,45 v39,46.5 | IC1.30 45,41.75 v45.15,41.9
  Bottom 0.127: v39,46.5 40,46.5 40.7,47.2 41.4,47.2 42.8,45.8 42.8,44.25 v45.15,41.9
AC1
  Top 1.27: J2.1 84.31,28.45 84.3,26.4 | F1.1 76.85,26.4 84.3,26.4 | X1.1 92.13,28.73 89.8,26.4 84.3,26.4
AC2
  Top 0.61: D6.A D7.C 84.6,36.14 D1.A
  Top 1.27: 87.27,35.18 J2.3 87.31,35.2 87.3,35.2 84.99,32.89 D1.A
  Bottom 1.27: J2.3 90.3,30.5 J2.2 92.03,32.2 93.95,32.2 X1.2
ACF
  Top 0.61: D1.C 80.9,36.9 83.5,39.5 83.5,45.9 D4.A D5.C
  Top 0.813: F1.2 76.05,36.95 78.87,36.95 D1.C
ALARM#  (via drill 0.2)
  Top 0.127: v41,46.6 44.6,46.6 45,46.2 IC3.17 | v34.5,41.9 33.2,40.6 26.15,40.6 23.05,37.5 20.8,37.5 19.65,36.35 R102.1 19.4,35.65 19.4,29.4 17.96,27.96 IC7.3
  Bottom 0.127: v34.5,41.9 38.1,45.5 39.9,45.5 v41,46.6
ALEDA  (via drill 0.2)
  Top 0.127: R39.1 v76.35,16.7
  Bottom 0.127: J8.11 93.03,19.33 91.9,18.2 89.2,18.2 85.6,21.9 81.55,21.9 v76.35,16.7
ALEDC  (via drill 0.2)
  Top 0.127: v73.1,18.8 73.35,18.55 IC13.4
  Bottom 0.127: J8.12 94.77,21.57 91.7,18.5 89.3,18.5 85.8,22.2 78.55,22.2 75.15,18.8 v73.1,18.8
ATCK  (via drill 0.2)
  Top 0.127: IC1.91 42.5,24.1 42.05,23.65 42.05,22.55 v41.9,22.4 RN6.1
  Bottom 0.127: v41.9,22.4 41.8,22.3 41.8,19.4 40.1,17.7 40.1,7.7 35.3,2.9 29.3,2.9 JP5.6
ATDI  (via drill 0.2)
  Top 0.127: IC1.89 v41.5,23.4 41.3,23.2 40.9,23.2 40.4,22.7 RN6.2
  Bottom 0.127: v41.5,23.4 41.3,23.2 41.3,22.4 39.5,20.6 39.5,7.9 36.4,4.8 15.4,4.8 JP5.19
ATDO  (via drill 0.2)
  Top 0.127: v41.95,26.7 42,26.65 IC1.90
  Bottom 0.127: v41.95,26.7 41.95,25.85 42.4,25.4 42.4,17 41,15.6 41,7.8 35.5,2.3 19.9,2.3 JP5.16
ATMS  (via drill 0.2)
  Top 0.127: RN6.3 39.6,23 39.8,23.2 40.4,23.2 40.8,23.6 v40.8,23.8 41,24 IC1.88 | JP5.5 29.7,7.1 35.5,7.1 36.4,8 v38.6,8
  Bottom 0.127: v38.6,8 39.2,8.6 39.2,21 40.8,22.6 v40.8,23.8
AVCC3  (via drill 0.2, 1)
  Top 0.152: C27.1 74,5.7 73.2,6.5 IC2.27
  Top 0.254: IC2.35 73.75,10.5 73.95,10.3 C28.1 v74.75,11.05 | 74,5.55 C27.1 v74,4.6 | IC2.28 71.3,7 71.3,6.5 IC2.27
  Top 0.406: R36.2 v79.7,10.3 | R35.2 v79.7,8.6 | C6.1 v79.7,11.8
  Top 1.016: FB2.1 v80.8,3.6
  pour Supply (isolate 0.254, no thermals): 69.85,11.43 69.85,2.54 83.19,2.54 83.19,13.34 75.88,13.34 75.88,11.43
BA20  (via drill 0.2)
  Top 0.127: IC4.9 | v31.7,15 IC4.9 | S2.2 2.79,31.74 3.5,31.03 3.5,29.6 6,27.1 v13.2,27.1
  Bottom 0.127: v31.7,15 30.8,15 30.3,15.5 30.3,19.2 24.4,25.1 14.7,25.1 13.2,26.6 v13.2,27.1
BA21  (via drill 0.2)
  Top 0.127: IC4.10 | v31.1,14.5 31.4,14.5 | 31.4,14.5 IC4.10 | 31.4,14.5 | S2.5 4.54,31.74 3.8,31 3.8,29.9 6.1,27.6 v12.4,27.6
  Bottom 0.127: v31.1,14.5 30.9,14.5 30,15.4 30,18.5 23.7,24.8 14.2,24.8 12.4,26.6 v12.4,27.6
BIAS
  Top 0.127: R42.2 72.47,4.47 | 72.47,4.47 IC2.26 | 72.47,4.47 72.45,4.45
CAR0  (via drill 0.2)
  Top 0.127: 56.6,64 | 56.6,64 IC3.71 | 56.6,64 v57.6,64 58.8,65.2 58.8,69.8 61,72 61,73.62 J5.23 | v61.5,55.2 64.2,52.5 J4.19
  Bottom 0.127: v57.6,64 56.5,62.9 56.5,60.1 61.4,55.2 v61.5,55.2
CAR1  (via drill 0.2)
  Top 0.127: J5.24 59.49,72.39 57.6,70.5 54.7,70.5 54,69.8 54,66.9 | 54,66.9 | 54,66.9 IC3.74 54,65.05 v54.3,64.75 | v60.6,55.2 64.3,51.5 J4.21
  Bottom 0.127: v60.6,55.2 60.6,55.6 56.2,60 56.2,62.85 v54.3,64.75
CAR2  (via drill 0.2)
  Top 0.127: J5.25 58.5,73.58 58.5,72 57.3,70.8 54.5,70.8 53.5,69.8 IC3.75 v53.5,64.1 | v59.7,55.2 63.9,51 J4.22
  Bottom 0.127: v59.7,55.2 59.7,56.1 55.9,59.9 55.9,61.7 v53.5,64.1
CAR3
  Top 0.127: J5.26 55.86,71.1 54.35,71.1 53,69.75 53,66.9 | 53,66.9 | IC3.76 53,66.9
CAR4
  Top 0.127: J5.27 55.9,73.64 55.9,72 55.3,71.4 54.2,71.4 52.5,69.7 52.5,66.5 IC3.77
CAR5
  Top 0.127: J5.28 52,69.78 52,66.7 | 52,66.7 | IC3.78 52,66.7
CAR6
  Top 0.127: J5.29 53.2,73.8 53.2,72 51.5,70.3 51.5,66.5 IC3.79
CAR7
  Top 0.127: J5.30 51.2,71.52 51.2,67.4 51,67.2 51,66.5 IC3.80
CAR8
  Top 0.127: J5.31 50.9,73.56 50.9,67.6 50.5,67.2 50.5,66.9 | 50.5,66.9 | IC3.81 50.5,66.9
CAR9
  Top 0.127: J5.32 49.53,71.37 50.6,70.25 50.6,67.8 50,67.2 50,66.75 | 50,66.75 | IC3.82 50,66.75
CAR10
  Top 0.127: J5.33 48.3,73.62 48.3,72.05 50.3,70 50.3,68 49.5,67.2 49.5,66.65 | 49.5,66.65 | IC3.83 49.5,66.65
CAR11
  Top 0.127: J5.34 48.1,71.28 48.1,67.7 48.5,67.3 48.5,66.5 IC3.85
CAR12
  Top 0.127: J5.35 45.8,73.58 45.8,70.7 47.8,68.7 47.8,67.4 48,67.2 48,66.7 | 48,66.7 | IC3.86 48,66.7
CAR13
  Top 0.127: IC3.87 47.5,68.2 44.45,71.25 J5.36
CAR14
  Top 0.127: J5.37 43.2,73.64 43.2,71.8 47,68 IC3.88
CAR15
  Top 0.127: IC3.91 45.5,68.8 J5.38
CCTS  (via drill 0.2)
  Top 0.127: IC6.15 v83.75,64.85 | IC3.44 56.5,50.5 v54.4,50.5
  Bottom 0.127: v54.4,50.5 55.5,50.5 55.9,50.9 66.2,50.9 67.9,52.6 71.4,52.6 72.2,53.4 72.2,61.5 73,62.3 81.45,62.3 83.75,64.6 v83.75,64.85
CDCD  (via drill 0.2)
  Top 0.127: IC6.19 v81.15,64.85 | IC3.48 56.5,52.5 v54.4,52.5
  Bottom 0.127: v54.4,52.5 55.7,52.5 56.4,51.8 65.9,51.8 68.2,54.1 68.2,61.5 69.9,63.2 79.75,63.2 81.15,64.6 v81.15,64.85
CDR0
  Top 0.127: IC3.59 65.9,58 68.4,55.5 J4.13 71.75,55.5 73.5,57.25 73.5,68.2 71.2,70.5 71.2,73.58 J5.15
CDR1
  Top 0.127: IC3.60 66.3,58.5 68.8,56 J4.12 71.5,56 73.2,57.7 73.2,67.6 69.85,70.95 J5.16
CDR2
  Top 0.127: IC3.61 66.7,59 68.7,57 J4.10 71.75,57 72.9,58.15 72.9,67 68.6,71.3 68.6,73.64 J5.17
CDR3
  Top 0.127: IC3.64 66.1,60.5 69.1,57.5 J4.9 71.5,57.5 72.6,58.6 72.6,66.4 67.31,71.69 J5.18
CDR4
  Top 0.127: IC3.66 66,61.5 69,58.5 J4.7 71.75,58.5 72.3,59.05 72.3,65.8 66.1,72 66.1,73.6 J5.19
CDR5
  Top 0.127: IC3.68 65.9,62.5 69.4,59 J4.6 71.5,59 72,59.5 72,65.16 J5.20
CDR6
  Top 0.127: IC3.69 66.3,63 69.3,60 J4.4 71.5,60 71.7,60.2 71.7,64.6 65.1,71.2 64.2,71.2 63.6,71.8 63.6,73 62.23,74.37 J5.21
CDR7
  Top 0.127: IC3.70 62.4,63.5 | 62.4,63.5 66.7,63.5 69.7,60.5 J4.3 | J5.22 62.4,72.22 62.4,63.5
CDSR  (via drill 0.2)
  Top 0.127: IC6.17 v82.45,64.85 | IC3.46 56.5,51.5 v54.4,51.5
  Bottom 0.127: v54.4,51.5 66,51.5 68.5,54 68.5,61.4 70,62.9 80.75,62.9 82.45,64.6 v82.45,64.85
CDTR  (via drill 0.2)
  Top 0.127: IC6.12 82.45,60.95 v82.3,61.1 | IC3.40 56.5,48.5 v55,48.5
  Bottom 0.127: v82.3,61.1 82,61.4 73.4,61.4 73.1,61.1 73.1,51.4 70.8,49.1 56.4,49.1 55.8,48.5 v55,48.5
CFON  (via drill 0.2)
  Top 0.127: IC6.23 78.55,65.82 v78.55,64.85 | IC3.52 56.5,54.5 v54.4,54.5
  Bottom 0.127: v54.4,54.5 55.5,54.5 57,53 65.5,53 67,54.5 67,61.9 70.7,65.6 77.8,65.6 v78.55,64.85
CLKA
  Top 0.127: IC5.10 57.83,30.43 58.8,31.4 R3.1
CLKB
  Top 0.127: IC5.9 57.23,31.33 57.4,31.5 R6.1
CLKBUF
  Top 0.127: IC5.6 61.83,29.77 60.2,31.4 R103.1
CLKC
  Top 0.127: R5.1 61.75,26.4 62.75,26.4 IC5.1
CLKD
  Top 0.127: IC5.7 63.83,30.43 64,30.6 64,33.2 63.8,33.4 R4.1
CLKE
  Top 0.127: R104.1 63.15,31.75 63.17,31.73 IC5.8
CLKOE  (via drill 0.2)
  Top 0.127: 56.25,55.5 | 56.25,55.5 IC3.54 | v53.1,55.5 56.25,55.5 | IC5.16 58.17,26.52 v58.3,26.4
  Bottom 0.127: v58.3,26.4 59.2,27.3 59.2,29.8 56.5,32.5 56.5,44.2 53.6,47.1 53.6,48.6 53.1,49.1 v53.1,55.5
CLKS2  (via drill 0.2)
  Top 0.127: IC3.39 53.35,48 v53.1,48.3 | IC5.15 58.17,27.18 v58.3,27.3
  Bottom 0.127: v58.3,27.3 58.9,27.9 58.9,29.7 56.2,32.4 56.2,44.1 53.1,47.2 v53.1,48.3
CNFOFF  (via drill 0.2)
  Top 0.127: IC6.22 v79.2,66.9 | IC3.51 56.5,54 v55,54
  Bottom 0.127: v55,54 55.4,54 56.7,52.7 65.6,52.7 67.3,54.4 67.3,61.8 69.6,64.1 78.7,64.1 79.2,64.6 v79.2,66.9
CNINVAL  (via drill 0.2)
  Top 0.127: IC6.21 v79.85,64.85 | IC3.50 56.5,53.5 v54.4,53.5
  Bottom 0.127: v54.4,53.5 55.5,53.5 56.6,52.4 65.7,52.4 67.6,54.3 67.6,61.7 69.7,63.8 79.05,63.8 79.85,64.6 v79.85,64.85
CPUCLK
  Top 0.127: IC1.82 38,24.2 38.3,23.9 38.3,21.8 38.5,21.6 41.6,21.6 42.2,21 45.3,21 46.2,21.9 55.75,21.9 R5.2
CRD  (via drill 0.2)
  Top 0.127: IC6.16 v83.1,66.9 | IC3.45 56.5,51 v55,51
  Bottom 0.127: v55,51 55.2,51.2 66.1,51.2 67.8,52.9 71.3,52.9 71.9,53.5 71.9,61.6 72.9,62.6 81.1,62.6 83.1,64.6 v83.1,66.9
CRI  (via drill 0.2)
  Top 0.127: IC6.20 v80.5,66.9 | IC3.49 56.5,53 v55,53
  Bottom 0.127: v55,53 55.6,53 56.5,52.1 65.8,52.1 67.9,54.2 67.9,61.6 69.8,63.5 79.4,63.5 80.5,64.6 v80.5,66.9
CRTS  (via drill 0.2)
  Top 0.127: IC3.43 56.5,50 v55,50 | IC6.14 v83.75,62
  Bottom 0.127: v55,50 55.55,50 56.15,50.6 66.3,50.6 67,51.3 71.6,51.3 72.5,52.2 72.5,61.4 73.1,62 v83.75,62
CTD  (via drill 0.2)
  Top 0.127: IC3.41 56.5,49 v54.4,49 | IC6.13 v83.1,61.5
  Bottom 0.127: v83.1,61.5 82.9,61.7 73.2,61.7 72.8,61.3 72.8,51.5 70.7,49.4 54.8,49.4 v54.4,49
CTS  (via drill 0.2)
  Top 0.127: RN2.3 v77.7,55.1 | IC6.8 79.84,59.16 v79.85,59.05
  Bottom 0.127: v77.7,55.1 79.85,57.25 v79.85,59.05
D0  (via drill 0.2)
  Top 0.127: v53.6,9.5 IC4.29 v51.3,9.5 | 44.5,44.9 | 44.5,44.9 IC3.16 | 44.5,44.9 IC1.31 44.5,39.5 v44.9,39.1 | v58.6,9.7 60.25,9.7 61.35,8.6 IC2.6
  Bottom 0.127: v51.3,9.5 51.5,9.7 51.5,17.8 49.1,20.2 49.1,31.2 44.9,35.4 v44.9,39.1 | v53.6,9.5 53.8,9.7 v58.6,9.7
D1  (via drill 0.2)
  Top 0.127: 52.5,10.5 v53.55,10.5 | IC4.31 52.5,10.5 | 52.5,10.5 v51,10.5 | 44,44.9 | 44,44.9 IC3.15 | 44,44.9 IC1.32 44,39.55 44.3,39.25 v44.3,38.6 | v58.6,10.5 59.95,10.5 61.85,8.6 IC2.7
  Bottom 0.127: v51,10.5 51.2,10.7 51.2,17.7 48.8,20.1 48.8,31.1 44.3,35.6 v44.3,38.6 | v53.55,10.5 53.9,10.1 58.2,10.1 v58.6,10.5
D2  (via drill 0.2)
  Top 0.127: v53.6,11.5 IC4.33 v50.7,11.5 | IC3.14 43.5,44.95 43.45,44.9 43.5,44.85 IC1.33 43.5,39.3 v43.7,39.1 | v58.6,11.5 59.45,11.5 62.35,8.6 IC2.8
  Bottom 0.127: v53.6,11.5 v58.6,11.5 | v50.7,11.5 50.9,11.7 50.9,17.6 48.5,20 48.5,31 43.7,35.8 v43.7,39.1
D3  (via drill 0.2)
  Top 0.127: v53.6,12.5 IC4.35 v50.4,12.5 | v43,38.6 IC1.34 43,44.9 | 43,44.9 | 43,44.9 IC3.13 | v58.6,12.5 58.95,12.5 62.85,8.6 IC2.9
  Bottom 0.127: v53.6,12.5 v58.6,12.5 | v50.4,12.5 50.6,12.7 50.6,17.5 48.2,19.9 48.2,30.9 43,36.1 v43,38.6
D4  (via drill 0.2)
  Top 0.127: IC4.38 52.4,14 v50.1,14 | v42.5,39.2 IC1.35 42.5,44.9 | 42.5,44.9 | 42.5,44.9 IC3.12 | v49.8,6.6 49.8,5.2 52.7,2.3 63.3,2.3 63.7,2.7 63.7,3.2 63.35,3.55 IC2.10
  Bottom 0.127: v49.8,6.6 49.9,6.7 49.9,13.8 v50.1,14 50.3,14.2 50.3,17.4 47.9,19.8 47.9,30.7 42.5,36.1 v42.5,39.2
D5  (via drill 0.2)
  Top 0.127: IC4.40 | v49.8,15 IC4.40 | v41.5,39.2 IC1.37 41.5,42.4 42,42.9 42,44.95 | 42,44.95 | 42,44.95 IC3.11 | v48.9,6.6 48.9,5.7 52.6,2 63.4,2 64,2.6 64,3.4 63.85,3.55 IC2.11
  Bottom 0.127: v48.9,6.6 49.6,7.3 49.6,14.8 v49.8,15 50,15.2 50,17.3 47.6,19.7 47.6,30.6 41.5,36.7 v41.5,39.2
D6  (via drill 0.2)
  Top 0.127: IC4.42 52.35,16 v49.5,16 | v41,38.6 IC1.38 41,42.3 41.5,42.8 41.5,44.85 41.45,44.9 41.5,44.95 IC3.10 | v48,6.6 48,6.2 52.5,1.7 63.5,1.7 64.35,2.55 IC2.12
  Bottom 0.127: v48,6.6 49.3,7.9 49.3,15.8 v49.5,16 49.7,16.2 49.7,17.2 47.3,19.6 47.3,30.5 41,36.8 v41,38.6
D7  (via drill 0.2)
  Top 0.127: IC4.44 53.25,17 v53.6,17 | IC2.13 64.85,10.35 v58.5,17 | IC4.44 | v49.2,17 IC4.44 | v40.5,39.2 IC1.39 40.5,42.2 41,42.7 41,44.8 | 41,44.8 | 41,44.8 IC3.9
  Bottom 0.127: v53.6,17 v58.5,17 | v49.2,17 49.2,17.3 47,19.5 47,30.4 40.5,36.9 v40.5,39.2
D8  (via drill 0.2)
  Top 0.127: v40,38.6 IC1.40 | v48.7,10 52.3,10 IC4.30 53.8,10 54.2,10.4 54.2,10.85 55,11.65 56.25,11.65 56.4,11.5 IC2.89
  Bottom 0.127: v48.7,10 48.7,17.4 46.7,19.4 46.7,30.3 40,37 v40,38.6
D9  (via drill 0.2)
  Top 0.127: v39.5,39.2 IC1.41 | v48.2,11 52.35,11 IC4.32 53.9,11 54.95,12.05 57.17,12.05 IC2.88
  Bottom 0.127: v48.2,11 48.4,11.2 48.4,17.3 46.4,19.3 46.4,30.2 39.5,37.1 v39.5,39.2
D10  (via drill 0.2)
  Top 0.127: IC2.87 54.4,12.5 53.9,12 IC4.34 52.4,12 v47.6,12 | v39,38.6 IC1.42
  Bottom 0.127: v47.6,12 48.1,12.5 48.1,17.2 46.1,19.2 46.1,30.1 39,37.2 v39,38.6
D11  (via drill 0.2)
  Top 0.127: 57.15,13 IC2.86 | 57.15,13 IC4.36 52.3,13 v47.6,13 | 57.15,13 | v38.5,39.2 IC1.43
  Bottom 0.127: v47.6,13 47.8,13.2 47.8,17.1 45.8,19.1 45.8,30 38.5,37.3 v38.5,39.2
D12  (via drill 0.2)
  Top 0.127: v37.5,39.2 IC1.45 | v47.3,14.5 IC4.39 53.15,14.5 53.25,14.4 55.2,14.4 56.1,13.5 IC2.85
  Bottom 0.127: v47.3,14.5 47.5,14.7 47.5,17 45.5,18.95 45.5,29.9 37.5,37.9 v37.5,39.2
D13  (via drill 0.2)
  Top 0.127: v37,38.6 IC1.46 | v47,15.5 IC4.41 53.1,15.5 53.6,16 54.7,16 55.5,15.2 55.5,14.5 56,14 IC2.84
  Bottom 0.127: v47,15.5 47.2,15.7 47.2,16.9 45.2,18.8 45.2,29.8 37,38 v37,38.6
D14  (via drill 0.2)
  Top 0.127: v36.5,39.2 IC1.47 | v46.7,16.5 IC4.43 54.7,16.5 55.8,15.4 55.8,14.8 56.1,14.5 IC2.83
  Bottom 0.127: v46.7,16.5 46.7,16.9 44.9,18.7 44.9,29.7 36.5,38.1 v36.5,39.2
D15  (via drill 0.2)
  Top 0.127: v36,38.6 IC1.48 36,42.75 36.25,43 36.75,43 37.5,43.75 37.5,44.7 | v45.3,17.5 IC4.45 54.2,17.5 56.1,15.6 56.1,15.2 56.3,15 IC2.82 | 37.5,44.7 | 37.5,44.7 IC3.2
  Bottom 0.127: v45.3,17.5 44.6,18.2 44.6,29.6 36,38.2 v36,38.6
DC  (via drill 0.2)
  Top 0.406: IC8.5 C2.1
  Top 0.61: C2.1 D4.C v82.4,44.8 D6.C
  Bottom 1.27: J5.10 77.47,70.2 90.5,70.2 95,65.7 95,57.65 95.02,57.63 R101.2 95.02,50.12 89.7,44.8 v82.4,44.8
DCD
  Top 0.127: IC6.4 77.25,59.76 77.25,59.75 77.25,58.7 76.4,57.85 76.4,56.3 75.9,55.8 75.9,52.1 78,50 RN1.4
DSR
  Top 0.127: IC6.6 78.55,59.8 78.55,59.1 77.85,58.4 77.45,58.4 76.7,57.65 76.7,56.2 76.2,55.7 76.2,52.6 78,50.8 RN1.3
DTR
  Top 0.127: IC6.11 81.8,58.2 80.8,57.2 78.05,57.2 77.9,57.05 77.9,56 78,55.9 RN2.2
FBUSY  (via drill 0.2)
  Top 0.127: v54.2,59.4 36.3,59.4 36.2,59.5 IC3.119 | v43.1,10.1 43.1,10.6 41.7,12 IC4.15
  Bottom 0.127: v43.1,10.1 48.4,4.8 60.7,4.8 61.6,5.7 61.6,22.8 60.1,24.3 60.1,30.1 59.3,30.9 59.3,43.6 60,44.3 60,47.2 59.2,48 54.6,48 53.6,49 53.6,58.8 v54.2,59.4
GND  (via drill 0.2, 1)
  Top 0.127: IC2.99 57.65,6.51 58.33,6.51 58.33,8 57.35,8 IC2.96 | C50.2 77.25,17.55
  Top 0.254: C56.2 v75,53.6 | C55.2 77.25,66.98 IC6.25 v77.25,64.8 | IC3.89 46.5,67.6 v46.25,67.6 46,67.6 IC3.90 | IC3.114 35,62 v36.6,62 | IC3.123 35,57.5 v36.6,57.5 | IC3.29 51,46.3 v50.8,46.5 | v55,52 56.5,52 IC3.47 58,52 C40.2 | C45.2 v58.9,54.5 | 57.95,48.5 C46.2 v58.9,48.5 | IC3.62 56.5,59.5 v57.8,59.5 | S1.S1 2.2,39.21 2.2,39.2 v4.85,39.2 | 50.15,36 IC1.19 | 50.15,36 v50.2,36 | IC1.18 50.15,35.5 50.15,36 | IC1.36 v42,41.85 | v35.95,22.55 35.95,23.5 C33.2 IC1.78 | C53.2 75.92,69.35 v74.8,69.35 | J4.2 v70.1,61 | J4.5 v70.1,59.5 | J4.8 v70.1,58 | J4.17 v69.75,53.5 | J4.20 v69.8,52 | 69.75,50.5 v69.8,50.5 J4.23 | C48.2 v15.2,40.9 | C51.2 v10.4,36.3 | C52.2 v15.2,36.3 | IC11.3 v7.55,36.4 | IC15.2 13,40.7 v12.7,41 12.35,40.65 IC15.3 | R34.2 v23.05,38.25 | 12.35,36.45 v12.35,36.4 IC12.3 | IC2.42 v71.2,14 | IC3.72 v56.3,65.2 | IC2.32 71.2,9 v71.2,8.75 71.2,8.5 IC2.31 | IC2.15 v65.85,5.65 | IC2.18 67.35,5.65 v67.6,5.65 67.85,5.65 IC2.19 | IC1.2 v49.9,27.5 | R14.1 v31.6,24.85 | IC4.46 | IC4.46 v53.6,18 | IC2.81 v58.5,15.5 | IC2.76 56.35,18 56.05,18.3 v56.05,18.5 | IC2.63 64.85,18.65 v64.6,18.4 64.35,18.65 IC2.64 | IC2.58 v67.35,18.35 | v71.2,17 IC2.48 73.45,17 73.95,17.5 C49.2 | C38.2 34.8,47 | 34.8,47 IC3.144 | C35.2 39.05,42.35 39.05,43.45 C41.2 38.6,43.4 v37.9,43.4 | C47.2 v34.8,44.6 | IC1.52 34.65,38.5 v34.65,38 IC1.53 | v45.25,42.75 C36.2 45.5,43.85 IC3.18 | C31.2 v48.25,43.05 | C29.2 v43.8,21.65 C32.2 | C20.2 v63.15,2.95 | C16.2 54.35,15 v54.95,15 | C37.2 50.6,33.65 v50.95,34 | J4.11 v70.1,56.5 | J4.14 v70.1,55 | IC2.23 C21.2 v70.85,3 | v31.4,31.5 31.55,31.5 32.05,32 IC1.65 | IC7.4 v16.6,26.7 | C17.2 v64.1,23.85 | IC5.3 64.08,27.82 v64.15,27.8 | IC5.11 56.23,29.77 C18.2 v56,30.5
  Top 0.254: C42.2 31.9,55.65 v31.9,56.4 | v40,24.1 IC1.86 IC1.87 | IC2.93 C19.2 55.9,9 | 55.9,9 v55.9,8.5 | 55.9,9 IC2.94 | v55.9,8.5 IC2.95 | IC2.96 56.4,8 v55.9,8.5 | C7.2 C6.2 77.2,11.75 77.1,11.75 v76.4,11.05 | C22.2 75.65,11.8 v76.4,11.05 | C28.2 75.55,10.35 75.7,10.35 v76.4,11.05 | C27.2 v76.4,5.5 | C50.2 77.15,17.6 77.15,17.75 v76.5,18.4 | IC13.2 74.75,19.7 v74.4,19.7 74.1,19.7 IC13.3 | IC14.2 78,19.7 v77.7,19.7 77.35,19.7 IC14.3 | v61.35,40.35 61.35,40.1 63.58,40.1 IC9.7 | IC2.25 v70.85,3 | v70.85,3 R42.1 | IC3.108 v36.3,66.3 | IC3.36 v54.5,43.8 | IC4.27 v53.6,8.5 | 34.8,47 v34.8,46.3 | C23.2 v70.35,22.1 | v58.5,22.2 58.5,21.15 C25.2 | v41.5,64.9 IC3.99 | v41.5,64.9 | v29.5,49.4 30.05,48.85 C30.2
  Top 0.305: S1.C1 6.21,40.56 v4.85,39.2
  Top 0.406: C26.2 v28.6,34 | C34.2 v28.6,32.8 | J6.C v29,69.15 | C43.2 v31.15,64.7 | C39.2 v48.85,70.6 | C44.2 v55.7,69.3 | C5.2 v28.9,55.2 | C24.2 25.86,30.51 25.85,30.5 v25.85,31.6 | R17.1 79.45,40.45 79.8,40.45 IC8.2 v79.8,43 | C4.2 74.85,47.7 v76.1,47.7 76.45,47.7 76.75,47.4 D8.A 78.1,47.4 78.6,47.9 C2.2 | v76.1,47.05 75.3,47.05 | D7.A v81.6,41.9 | v15.2,31.6 C102.1 | C8.2 v79.7,6.9 | IC10.2 v17.9,39.2
  Top 0.61: C2.2 D5.A | C10.2 v61.35,40.35 C11.2 | v67.6,64.7 J4.G1 | v67.6,46.8 J4.G2
  Top 1.016: J6.6 21.8,61.72 v21.8,61.7 | 21.8,54.22 v21.8,54.25 | J6.3 21.8,54.22 | 21.8,54.22 21.8,54.2
  Ground 0.127: 12.7,2.54 12.65,2.52 12.6,2.55
  other vias: 61.35,39.2 67.94,28.57 72.71,22.61 72.71,37.15 60.8,29.8 60.8,26.4 62.1,27.8 64.2,29.8
  pour Ground (isolate 0.254): 7.62,77.47 7.62,41.91 3.17,41.91 3.17,8.26 12.7,8.26 12.7,2.54 83.19,2.54 83.19,15.24 80.01,15.24 80.01,36.83 85.72,36.83 85.72,48.26 82.55,48.26 82.55,57.78 88.9,57.78 88.9,59.69 85.72,59.69 85.72,69.22 89.53,69.22 89.53,77.47
  pour Top (isolate 0.203): 0.64,41.91 27.3,41.91 27.3,25.4 0.64,25.4
  pour Top (isolate 0.203): 53.98,43.18 68.58,43.18 68.58,37.47 73.03,37.47 73.03,5.4 53.98,5.4
LLEDA
  Top 0.127: J8.9 94.77,9.23 93.6,10.4 93.6,11 83.4,21.2 81.4,21.2 80.5,20.3 80.5,15.9 79.3,14.7 R107.1 78.05,14 76.2,14 R8.1
LLEDC
  Top 0.127: J8.10 93.85,11.15 83.5,21.5 81.3,21.5 80.2,20.4 80.2,17 79.3,16.1 R7.1 78.05,15.4 76.75,15.4 76.65,15.3 76.1,15.3 R108.1
LLEDOUT  (via drill 0.2)
  Top 0.127: IC14.4 77.65,18.55 78,18.2 78,16.4 77.7,16.1 R7.2 77.05,15.9 v76.4,15.9 | R107.2 v76.4,14.7
  Bottom 0.127: v76.4,14.7 v76.4,15.9
MCD  (via drill 0.2)
  Top 0.127: 34.8,59 | 34.8,59 IC3.120 | v33.8,59 34.8,59 | J6.CD 27.67,68 30,68 v30.1,67.9 | RN4.2 v31.7,53.3
  Bottom 0.127: v30.1,67.9 32.8,65.2 32.8,60 v33.8,59 34.4,58.4 34.4,56 v31.7,53.3
MCLK
  Top 0.127: IC3.125 35,56.5 34.1,56.5 33.1,57.5 26.15,57.5 24.45,59.2 18.75,59.2 18.73,59.22 J6.5
MCMD  (via drill 0.2)
  Top 0.127: v31.9,59 RN5.3 | IC3.126 34.2,56 33.2,57 v32.5,57 31.65,57 30.7,56.05 26.95,56.05 22.62,51.72 J6.2
  Bottom 0.127: v31.9,59 32.5,58.4 v32.5,57
MDAT0  (via drill 0.2)
  Top 0.127: IC3.124 35,57 34,57 33,58 v31.1,58 27.2,58 21.05,64.15 J6.7 | v31.1,59 RN5.2
  Bottom 0.127: v31.1,58 v31.1,59
MDAT1
  Top 0.127: J6.8 21.02,65.78 28.3,58.5 30.3,58.5 | IC3.121 35,58.5 30.3,58.5 | 30.3,58.5 RN5.1
MDAT2  (via drill 0.2)
  Top 0.127: v30.1,53.3 RN4.4 | v30.1,53.3 30.1,53.5 30.5,53.9 33.5,53.9 34.1,54.5 34.75,54.5 | 34.75,54.5 | 34.75,54.5 IC3.129 | J6.9 20.02,46.72 26.6,53.3 v30.1,53.3
MDAT3  (via drill 0.2)
  Top 0.127: 34.8,55 | 34.8,55 IC3.128 | v30.9,53.3 RN4.3 | 34.8,55 34,55 33.5,54.5 v30.9,54.5 26.6,54.5 21.32,49.22 J6.1
  Bottom 0.127: v30.9,54.5 v30.9,53.3
MWP  (via drill 0.2)
  Top 0.127: 34.8,54 | 34.8,54 IC3.130 | 34.8,54 34.2,54 33.3,53.1 32.7,53.1 32.5,52.9 RN4.1 32.5,51.7 32.1,51.3 v26.3,51.3 | J6.WP 27.67,43.4 v26.3,43.4
  Bottom 0.127: v26.3,43.4 v26.3,51.3
N$1
  Top 0.254: C55.1 75.95,66.95 75.94,66.94 IC6.27
N$2
  Top 0.254: 75,56.2 C56.1 75.5,56.15 75.9,56.55 75.9,57.9 76.6,58.6 76.6,59.7 76.59,59.7 IC6.3
N$3
  Top 0.254: C57.2 75.05,58 75.2,58.15 75.55,58.15 75.95,58.55 75.95,59.8 75.94,59.8 IC6.2
N$5
  Top 0.127: S1.C2 9.64,37.86 10.5,37 11.65,37 12.35,37.7 IC15.4
N$8
  Top 0.254: IC6.1 75.3,59.15 C57.1
N$9
  Top 0.254: IC6.24 77.89,66.34 78.15,66.6 78.15,67.9 77.8,68.25 C54.2
N$10
  Top 0.254: IC6.28 75.3,66.31 75,66.6 75,67.95 75.3,68.25 C54.1
N$13
  Top 0.406: IC8.3 80.75,40.4 R17.2 R19.1
N$18
  Top 0.254: IC9.3 57.92,39.48 C12.1
N$19
  Top 0.254: IC9.2 57.92,40.12 C12.2
N$21
  Top 0.254: C13.1 64.8,39.5 63.62,39.5 IC9.6
N$23
  Top 0.254: C13.2 64.9,40.8 63.62,40.8 IC9.8
N$45
  Top 0.127: Y1.2 66.4,26.85 64.78,28.48 IC5.4
N$46
  Top 0.127: Y1.1 66.4,30.75 64.78,29.12 IC5.5
N$49
  Top 0.127: S1.A1 1.95,40.95 2.4,41.4 10.2,41.4 10.8,40.8 R32.1
N$50
  Top 0.127: R33.1 1.95,36.45 1.9,36.5 1.95,36.55 S1.A2
NCRD
  Top 0.127: IC3.57 65.1,57 68.1,54 J4.16 71.75,54 74.1,56.35 74.1,69.4 73.7,69.8 73.7,73.62 J5.13
NCS0  (via drill 0.2)
  Top 0.127: v51.32,8 51.85,8 IC4.26 | v38,46.5 IC3.3 | v49.6,22.8 48.7,22.8 48.3,23.2 46.4,23.2 45.5,24.1 IC1.97 45.5,26.35 44.4,27.4 41.5,27.4 v40.8,26.7
  Bottom 0.127: v49.6,22.8 49.4,22.6 49.4,20.3 51.8,17.9 51.8,8.48 v51.32,8 | v38,46.5 37,45.5 34.7,45.5 34,44.8 34,39.5 36.1,37.4 36.1,36.5 36.5,36.1 36.5,35.7 36.2,35.4 36.2,34.8 36.4,34.6 38,34.6 43,29.6 43,28.8 41.9,27.7 41.6,27.7 40.8,26.9 v40.8,26.7
NCS1  (via drill 0.2)
  Top 0.127: IC1.98 46,24.1 46.6,23.5 48.5,23.5 48.7,23.3 v53.2,23.3 | IC2.3 59.9,4.42 v59.9,6.5
  Bottom 0.127: v53.2,23.3 58.65,23.3 59.9,22.05 v59.9,6.5
NCWR
  Top 0.127: IC3.58 65.5,57.5 68.5,54.5 J4.15 71.5,54.5 73.8,56.8 73.8,68.8 72.39,70.21 J5.14
NFBYTE  (via drill 0.2)
  Top 0.127: IC4.47 v54.2,18.5 | IC3.22 47.5,46.5 v47.5,47.2 | v53.35,42.75 53.35,40.95 52.8,40.4 52.8,29.65 52.81,29.65 52.8,29.6 52.8,27.2 v52.9,27.1
  Bottom 0.127: v54.2,18.5 54.2,21 52.3,22.9 52.3,26.5 v52.9,27.1 | v47.5,47.2 48.9,47.2 v53.35,42.75
NICCLK
  Top 0.127: 59.5,33.55 R3.2 | 59.5,33.55 R103.2 | 59.5,33.55 59.5,31 60,30.5 60,24.5 57.6,22.1 57.6,19.4 58.4,18.6 58.7,18.6 69.35,7.95 IC2.22
NLEDA\
  Top 0.127: R23.1 78.75,21.45 78.65,21.35 IC14.1 78.65,19.45 78.3,19.1 73.9,19.1 73.6,19.4 72.6,19.4 70.7,17.5 66.4,17.5 65.35,18.55 IC2.62
NLEDB\
  Top 0.127: R18.1 75.5,21.45 75.4,21.35 75.4,21 | 75.4,21 IC13.1 | 75.4,21 73.8,21 70.6,17.8 66.6,17.8 65.85,18.55 IC2.61
NMR  (via drill 0.2)
  Top 0.127: IC10.4 16.6,39.6 16.2,39.2 11.7,39.2 | S1.S2 v9.3,39.2 11.7,39.2 | v39,47.3 37.3,47.3 35.5,45.5 32.05,45.5 31.7,45.85 R30.1 C30.1 30.05,45.85 29.7,45.5 16.2,45.5 11.7,41 11.7,39.2 | v40,47.3 IC3.7 | v40,47.3
  Bottom 0.127: J5.9 76.24,73.7 41.45,73.7 40.7,72.95 40.7,65.4 38.5,62.6 38.5,47.8 v39,47.3 v40,47.3 | J7.6 9,18.94 9,38.9 v9.3,39.2
NOE  (via drill 0.2)
  Top 0.127: v54.4,9 53.8,9 IC4.28 51,9 50.5,9.5 42,9.5 v41.8,9.7 | IC2.1 v58.85,8.3 v60.75,8.3 | IC3.6 39.5,45 39.5,47.6 39.8,47.9 41.8,47.9 42.3,47.4 45.8,47.4 46.2,47.8 52,47.8 52.3,47.5 v54.5,47.5 | v43,26.7 IC1.92
  Bottom 0.127: v43,26.7 43,16.8 42,15.8 42,9.9 v41.8,9.7 | v60.75,8.3 60.8,8.35 60.8,22.8 59.5,24.1 59.5,29.9 58.7,30.7 58.7,43.3 v54.5,47.5 | v54.4,9 54.7,9.3 57.85,9.3 v58.85,8.3
NRESET  (via drill 0.2)
  Top 0.127: 35.25,47.5 | 35.25,47.5 IC3.143 | IC10.1 R34.1 20.65,38.75 21,39.1 22.4,39.1 24.2,40.9 29.2,40.9 v29.5,41.3 | v36,21.7 36.8,22.5 36.8,23.95 36.5,24.25 IC1.79 36.5,26.3 36.1,26.7 34.9,26.7 34,25.8 v32.3,25.8 | IC4.12 | IC4.12 35.8,13.5 v36,13.3 42.8,13.3 44.5,15 44.5,17.7 44.9,18.1 50.1,18.1 51.4,19.4 53,19.4 53.2,19.6 54,19.6 54.8,18.8 54.8,17.5 56.3,16 IC2.80 | 35.25,47.5 34.35,47.5 34.1,47.75 29.6,47.75 29.3,47.45 29.3,46.3 v29.5,46.1
  Bottom 0.127: v36,13.3 v36,21.7 | v32.3,25.8 32.3,31.7 30,34 30,35.5 29.8,35.7 29.8,41 v29.5,41.3 v29.5,46.1
NWAIT  (via drill 0.2)
  Top 0.127: IC1.96 45,24.1 46.2,22.9 48.1,22.9 48.8,22.2 53.7,22.2 54.5,23 v54.5,23.95 | IC3.21 47,46.1 v47,46.5 | v60.5,5.9 60.35,5.75 IC2.4 | v54,42.2 53.9,42.1 v53.9,33.4 | R16.2 60.6,22.1 v60.2,22.5
  Bottom 0.127: v54,42.2 53.1,42.2 48.8,46.5 v47,46.5 | v60.5,5.9 60.5,6.9 60.2,7.2 v60.2,22.5 59.1,23.6 54.8,23.6 v54.5,23.95 53.9,24.55 v53.9,33.4
NWE  (via drill 0.2)
  Top 0.127: IC4.11 v42.5,14 | v59.4,5.65 59.4,4.42 IC2.2 59.35,3.55 59.1,3.3 58.65,3.3 58.4,3.55 58.4,4.4 57.4,5.4 56.4,5.4 55.4,6.4 50.8,6.4 49.5,7.7 47.5,7.7 46.9,8.3 v42.5,8.3 | v43.8,26.7 43.5,26.25 IC1.93 | v54.2,60.6 36.3,60.6 36.2,60.5 IC3.117 | v59.35,46.75 59.6,47 59.6,51.5 v57.6,53.5
  Bottom 0.127: v43.8,26.7 43.3,26.05 43.3,14.8 v42.5,14 v42.5,8.3 | v59.4,5.65 59.75,5.25 60.75,5.25 61.3,5.8 61.3,22.7 59.8,24.2 59.8,30 59,30.8 59,43.7 59.35,44.05 v59.35,46.75 | v54.2,60.6 57.6,57.2 v57.6,53.5
P0  (via drill 0.2)
  Top 0.127: IC1.49 35.5,42.1 34.8,42.8 33.5,42.8 32.8,42.1 30.9,42.1 30.6,42.4 28.8,42.4 28.5,42.1 v26.3,42.1
  Bottom 0.127: v26.3,42.1 25.7,42.7 25.7,67.7 29.3,71.3 29.8,71.3 30.5,72 30.5,73.64 J5.47
P1  (via drill 0.2)
  Top 0.127: IC1.50 35,42.15 34.65,42.5 33.7,42.5 32.9,41.7 30.7,41.7 30.4,42 29,42 28.5,41.5 v25.7,41.5
  Bottom 0.127: J5.48 29.21,71.61 25.4,67.8 25.4,41.8 v25.7,41.5
P2  (via drill 0.2)
  Top 0.127: IC1.51 27,39 v26.6,39.4
  Bottom 0.127: J5.49 27.9,73.7 27.9,72 25.1,69.2 25.1,40.5 26.2,39.4 v26.6,39.4
P3  (via drill 0.2)
  Top 0.127: J5.50 27.76,71.3 32.3,71.3 33.81,69.8 38.4,69.8 41,67.2 IC3.100 | IC1.54 32.5,37.5 31.4,38.6 v26.6,38.6
  Bottom 0.127: J5.50 24.8,70.52 24.8,40 26.2,38.6 v26.6,38.6
P4  (via drill 0.2)
  Top 0.127: IC3.101 40.5,67.2 38.2,69.5 33.6,69.5 32.1,71 26.5,71 25.4,72.1 25.4,74 24.47,74.93 J5.51 | IC1.55 32.4,37 31.6,37.8 v26.6,37.8
  Bottom 0.127: v26.6,37.8 26.2,37.8 24.5,39.5 24.5,70.8 25.3,71.6 25.3,73.76 J5.51
P5  (via drill 0.2)
  Top 0.127: J5.52 24.16,71.94 24.16,71.39 24.85,70.7 31.9,70.7 33.4,69.2 38,69.2 40,67.2 IC3.102 | IC1.56 32.3,36.5 31.8,37 v26.6,37
  Bottom 0.127: J5.52 24.2,72.32 24.2,39 26.2,37 v26.6,37
P6  (via drill 0.2)
  Top 0.127: IC1.57 32.3,36 32.1,36.2 v26.6,36.2 | IC3.103 39.5,67.2 37.8,68.9 33.2,68.9 31.7,70.4 24.05,70.4 22.9,71.55 22.9,74.3 22.27,74.93 J5.53
  Bottom 0.127: v26.6,36.2 26.4,36.2 23.9,38.7 23.9,69 22.9,70 22.9,73.62 J5.53
P7  (via drill 0.2)